# Altium project ADCBoard.PrjPCB
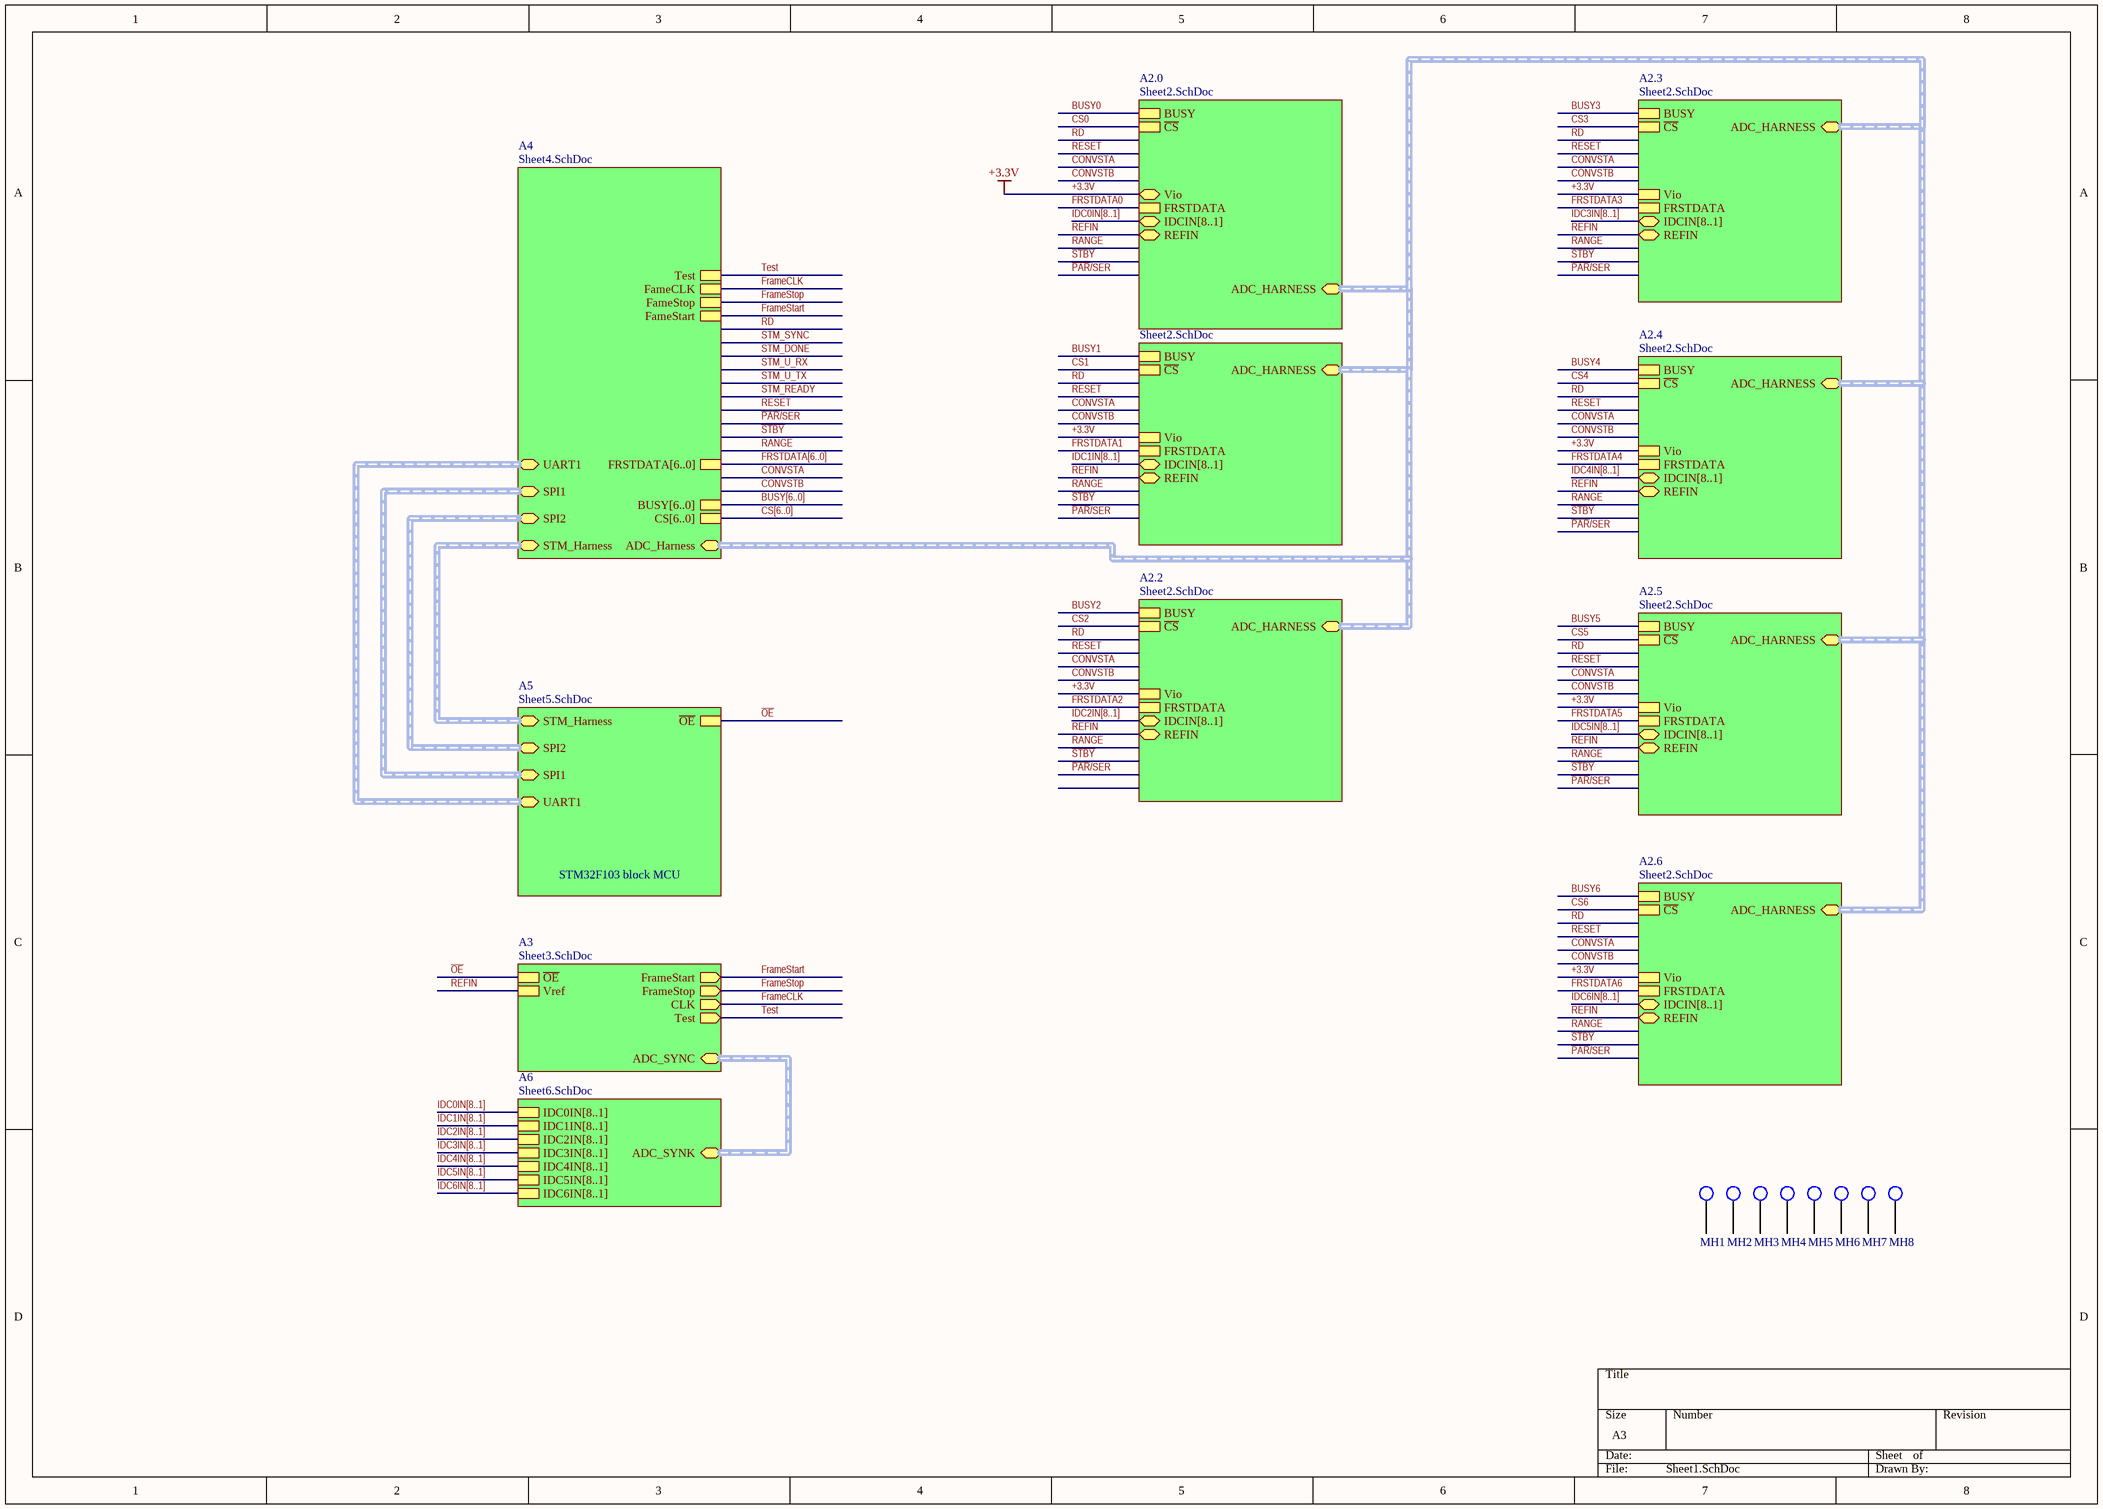
[diagram p0: Sheet1.SchDoc]
6 sheets, 430 parts. Net scope: hierarchical (ports join the sheet entries above them; power ports are global).
Board file: ADCBoard.PcbDoc
Sheets:
  Sheet1.SchDoc
    A2.3 = Sheet2.SchDoc
    A2.4 = Sheet2.SchDoc
    A2.5 = Sheet2.SchDoc
    A2.6 = Sheet2.SchDoc
    A2.1 = Sheet2.SchDoc
    A2.2 = Sheet2.SchDoc
    A4 = Sheet4.SchDoc
    A3 = Sheet3.SchDoc
    A5 = Sheet5.SchDoc
    A2.0 = Sheet2.SchDoc
    A6 = Sheet6.SchDoc

## Sheet Sheet1.SchDoc
size A3; DocumentNumber: 1; SheetNumber: 1; SheetTotal: 6

### Parts
MH1  HOLE  [MT]  (value not drawn)
MH2  HOLE  [MT]  (value not drawn)
MH3  HOLE  [MT]  (value not drawn)
MH4  HOLE  [MT]  (value not drawn)
MH5  HOLE  [MT]  (value not drawn)
MH6  HOLE  [MT]  (value not drawn)
MH7  HOLE  [MT]  (value not drawn)
MH8  HOLE  [MT]  (value not drawn)

### Sub-sheets
A2.0 = Sheet2.SchDoc: BUSY, ~{CS}, FRSTDATA, ADC_HARNESS (harness ADC_Harness), Vio, IDCIN[8..1], REFIN
A2.1 = Sheet2.SchDoc: BUSY, ~{CS}, Vio, FRSTDATA, ADC_HARNESS (harness ADC_Harness), IDCIN[8..1], REFIN
A2.2 = Sheet2.SchDoc: BUSY, ~{CS}, Vio, FRSTDATA, ADC_HARNESS (harness ADC_Harness), IDCIN[8..1], REFIN
A2.3 = Sheet2.SchDoc: BUSY, ~{CS}, Vio, FRSTDATA, ADC_HARNESS (harness ADC_Harness), IDCIN[8..1], REFIN
A2.4 = Sheet2.SchDoc: BUSY, ~{CS}, Vio, FRSTDATA, ADC_HARNESS (harness ADC_Harness), IDCIN[8..1], REFIN
A2.5 = Sheet2.SchDoc: BUSY, ~{CS}, Vio, FRSTDATA, ADC_HARNESS (harness ADC_Harness), IDCIN[8..1], REFIN
A2.6 = Sheet2.SchDoc: BUSY, ~{CS}, Vio, FRSTDATA, ADC_HARNESS (harness ADC_Harness), IDCIN[8..1], REFIN
A3 = Sheet3.SchDoc: FrameStart (out), FrameStop (out), CLK (out), ~{OE}, Test (out), Vref, ADC_SYNC (harness ADC_SYNC)
A4 = Sheet4.SchDoc: CS[6..0], BUSY[6..0], FRSTDATA[6..0], FameStart, FameStop, FameCLK, Test, ADC_Harness (harness ADC_Harness), STM_Harness (harness STM_Harness), SPI1 (harness SPI), SPI2 (harness SPI), UART1 (harness UART)
A5 = Sheet5.SchDoc: ~{OE}, STM_Harness (harness STM_Harness), SPI1 (harness SPI), SPI2 (harness SPI), UART1 (harness UART)  | BlockTitle: STM32F103 block MCU
A6 = Sheet6.SchDoc: IDC0IN[8..1], IDC1IN[8..1], IDC2IN[8..1], IDC3IN[8..1], IDC4IN[8..1], IDC5IN[8..1], IDC6IN[8..1], ADC_SYNK (harness ADC_SYNC)

### Nets
+3.3V: sheet A2.3/Vio, sheet A2.4/Vio, sheet A2.5/Vio, sheet A2.6/Vio, sheet A2.1/Vio, sheet A2.2/Vio, sheet A2.0/Vio
FrameCLK: sheet A4/FameCLK, sheet A3/CLK  [project net CLK]
FrameStart: sheet A4/FameStart, sheet A3/FrameStart
FrameStop: sheet A4/FameStop, sheet A3/FrameStop
~{OE}: sheet A3/~{OE}, sheet A5/~{OE}
REFIN: sheet A2.3/REFIN, sheet A2.4/REFIN, sheet A2.5/REFIN, sheet A2.6/REFIN, sheet A2.1/REFIN, sheet A2.2/REFIN, sheet A3/Vref, sheet A2.0/REFIN
Test: sheet A4/Test, sheet A3/Test

Not connected (* = marked no-connect by the designer): MH1 1; MH2 1; MH3 1; MH4 1; MH5 1; MH6 1; MH7 1; MH8 1

### Buses and harness runs
bus BUSY[6..0] = sheet A4/BUSY[6..0]
bus CS[6..0] = sheet A4/CS[6..0]
bus FRSTDATA[6..0] = sheet A4/FRSTDATA[6..0]
bus IDC0IN[8..1] = sheet A2.0/IDCIN[8..1]
bus IDC0IN[8..1] = sheet A6/IDC0IN[8..1]
bus IDC1IN[8..1] = sheet A2.1/IDCIN[8..1]
bus IDC1IN[8..1] = sheet A6/IDC1IN[8..1]
bus IDC2IN[8..1] = sheet A2.2/IDCIN[8..1]
bus IDC2IN[8..1] = sheet A6/IDC2IN[8..1]
bus IDC3IN[8..1] = sheet A2.3/IDCIN[8..1]
bus IDC3IN[8..1] = sheet A6/IDC3IN[8..1]
bus IDC4IN[8..1] = sheet A2.4/IDCIN[8..1]
bus IDC4IN[8..1] = sheet A6/IDC4IN[8..1]
bus IDC5IN[8..1] = sheet A2.5/IDCIN[8..1]
bus IDC5IN[8..1] = sheet A6/IDC5IN[8..1]
bus IDC6IN[8..1] = sheet A2.6/IDCIN[8..1]
bus IDC6IN[8..1] = sheet A6/IDC6IN[8..1]
harness sheet A2.0/ADC_HARNESS = sheet A2.1/ADC_HARNESS = sheet A2.2/ADC_HARNESS = sheet A2.3/ADC_HARNESS = sheet A2.4/ADC_HARNESS = sheet A2.5/ADC_HARNESS = sheet A2.6/ADC_HARNESS = sheet A4/ADC_Harness
harness sheet A3/ADC_SYNC = sheet A6/ADC_SYNK
harness sheet A4/SPI1 = sheet A5/SPI1
harness sheet A4/SPI2 = sheet A5/SPI2
harness sheet A4/STM_Harness = sheet A5/STM_Harness
harness sheet A4/UART1 = sheet A5/UART1

### Library data of the parts
MH1-MH8 = MT

## Sheet Sheet2.SchDoc
size A3; DocumentNumber: 2; SheetNumber: 2; SheetTotal: 6
Used 7 times, as channels A2.3, A2.4, A2.5, A2.6, A2.1, A2.2, A2.0. Parts and nets are listed once, with the designators drawn on the sheet.
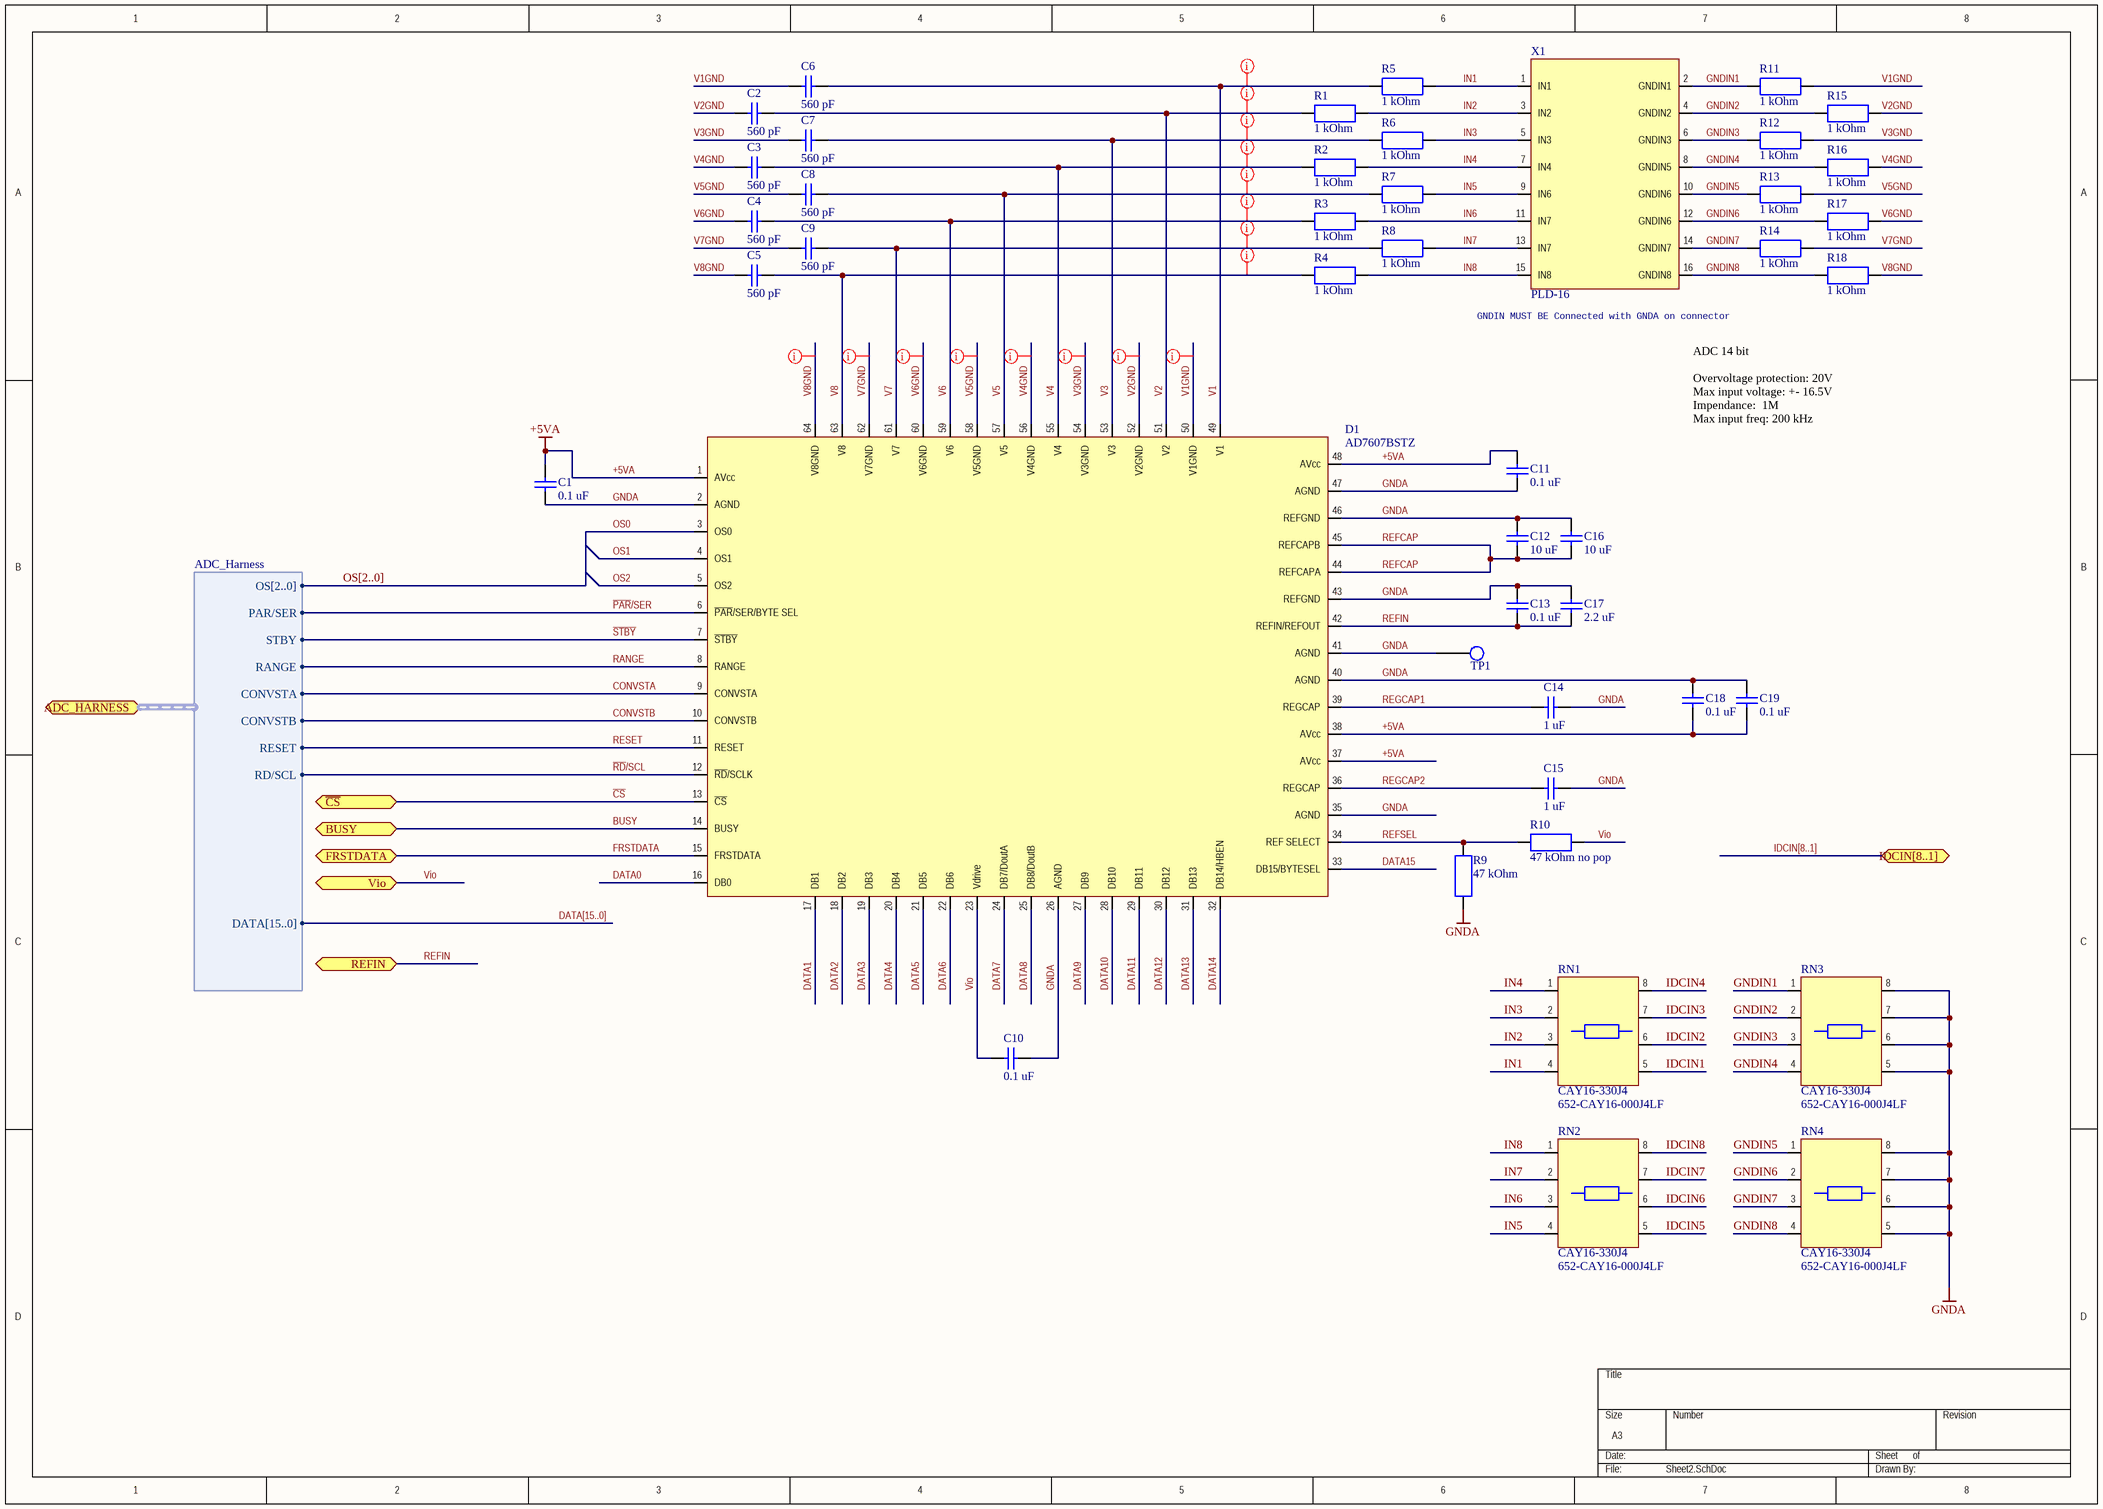
[diagram p1: Sheet2.SchDoc]

### Parts
C1  0.1 uF  [CAPC1608N]
C2  560 pF  [CAPC1608N]
C3  560 pF  [CAPC1608N]
C4  560 pF  [CAPC1608N]
C5  560 pF  [CAPC1608N]
C6  560 pF  [CAPC1608N]
C7  560 pF  [CAPC1608N]
C8  560 pF  [CAPC1608N]
C9  560 pF  [CAPC1608N]
C10  0.1 uF  [CAPC1608N]
C11  0.1 uF  [CAPC1608N]
C12  10 uF  [CAPC1608N]
C13  0.1 uF  [CAPC1608N]
C14  1 uF  [CAPC1608N]
C15  1 uF  [CAPC1608N]
C16  10 uF  [CAPC1608N]
C17  2.2 uF  [CAPC1608N]
C18  0.1 uF  [CAPC1608N]
C19  0.1 uF  [CAPC1608N]
D1  AD7607BSTZ  [TSQFP50P1200X1200X160-64N]
R1  1 kOhm  [RESC1608N]
R2  1 kOhm  [RESC1608N]
R3  1 kOhm  [RESC1608N]
R4  1 kOhm  [RESC1608N]
R5  1 kOhm  [RESC1608N]
R6  1 kOhm  [RESC1608N]
R7  1 kOhm  [RESC1608N]
R8  1 kOhm  [RESC1608N]
R9  47 kOhm  [RESC1608N]
R10  47 kOhm no pop  [RESC1608N]
R11  1 kOhm  [RESC1608N]
R12  1 kOhm  [RESC1608N]
R13  1 kOhm  [RESC1608N]
R14  1 kOhm  [RESC1608N]
R15  1 kOhm  [RESC1608N]
R16  1 kOhm  [RESC1608N]
R17  1 kOhm  [RESC1608N]
R18  1 kOhm  [RESC1608N]
RN1  CAY16-330J4  Supplier Part Number 1: 652-CAY16-000J4LF  [EXB38V]
RN2  CAY16-330J4  Supplier Part Number 1: 652-CAY16-000J4LF  [EXB38V]
RN3  CAY16-330J4  Supplier Part Number 1: 652-CAY16-000J4LF  [EXB38V]
RN4  CAY16-330J4  Supplier Part Number 1: 652-CAY16-000J4LF  [EXB38V]
TP1  PLS-1  [TPSW]  (value not drawn)
X1  PLD-16  [PLD-16]

### Ports
ADC_HARNESS (harness ADC_Harness), BUSY, FRSTDATA, IDCIN[8..1], REFIN, Vio, ~{CS}

### Harnesses
ADC_Harness: OS[2..0], PAR/SER, RANGE, STBY, CONVSTA, CONVSTB, RESET, RD/SCL, DATA[15..0]

### Nets
+5VA: C1.2 C11.2 C18.1 C19.1 D1.1(AVcc) D1.37(AVcc) D1.38(AVcc) D1.48(AVcc)
GNDA: C1.1 C10.1 C11.1 C12.2 C13.2 C14.1 C15.1 C16.2 C17.2 C18.2 C19.2 D1.2(AGND) D1.26(AGND) D1.35(AGND) D1.40(AGND) D1.41(AGND) D1.43(REFGND) D1.46(REFGND) D1.47(AGND) R9.1 RN3.5 RN3.6 RN3.7 RN3.8 RN4.5 RN4.6 RN4.7 RN4.8 TP1.1
BUSY: D1.14(BUSY) ; port BUSY
~{CS}: D1.13(~{CS}) ; port ~{CS}
CONVSTA: D1.9(CONVSTA) ; port ADC_HARNESS.CONVSTA
CONVSTB: D1.10(CONVSTB) ; port ADC_HARNESS.CONVSTB
DATA0: D1.16(DB0)
DATA1: D1.17(DB1)
DATA2: D1.18(DB2)
DATA3: D1.19(DB3)
DATA4: D1.20(DB4)
DATA5: D1.21(DB5)
DATA6: D1.22(DB6)
DATA7: D1.24(DB7/DoutA)
DATA8: D1.25(DB8/DoutB)
DATA9: D1.27(DB9)
DATA10: D1.28(DB10)
DATA11: D1.29(DB11)
DATA12: D1.30(DB12)
DATA13: D1.31(DB13)
DATA14: D1.32(DB14/HBEN)
DATA15: D1.33(DB15/BYTESEL)
FRSTDATA: D1.15(FRSTDATA) ; port FRSTDATA
GNDIN1: R11.1 RN3.1 X1.2(GNDIN1)
GNDIN2: R15.1 RN3.2 X1.4(GNDIN2)
GNDIN3: R12.1 RN3.3 X1.6(GNDIN3)
GNDIN4: R16.1 RN3.4 X1.8(GNDIN5)
GNDIN5: R13.1 RN4.1 X1.10(GNDIN6)
GNDIN6: R17.1 RN4.2 X1.12(GNDIN6)
GNDIN7: R14.1 RN4.3 X1.14(GNDIN7)
GNDIN8: R18.1 RN4.4 X1.16(GNDIN8)
IDCIN1: RN1.5
IDCIN2: RN1.6
IDCIN3: RN1.7
IDCIN4: RN1.8
IDCIN5: RN2.5
IDCIN6: RN2.6
IDCIN7: RN2.7
IDCIN8: RN2.8
IN1: R5.1 RN1.4 X1.1(IN1)
IN2: R1.1 RN1.3 X1.3(IN2)
IN3: R6.1 RN1.2 X1.5(IN3)
IN4: R2.1 RN1.1 X1.7(IN4)
IN5: R7.1 RN2.4 X1.9(IN6)
IN6: R3.1 RN2.3 X1.11(IN7)
IN7: R8.1 RN2.2 X1.13(IN7)
IN8: R4.1 RN2.1 X1.15(IN8)
OS0: D1.3(OS0)
OS1: D1.4(OS1)
OS2: D1.5(OS2)
~{PAR}/SER: D1.6(~{PAR}/SER/BYTE_SEL) ; port ADC_HARNESS.PAR/SER
~{RD}/SCL: D1.12(~{RD}/SCLK) ; port ADC_HARNESS.RD/SCL
RANGE: D1.8(RANGE) ; port ADC_HARNESS.RANGE
REFCAP: C12.1 C16.1 D1.44(REFCAPA) D1.45(REFCAPB)
REFIN: C13.1 C17.1 D1.42(REFIN/REFOUT) ; port REFIN
REFSEL: D1.34(REF_SELECT) R9.2 R10.2
REGCAP1: C14.2 D1.39(REGCAP)
REGCAP2: C15.2 D1.36(REGCAP)
RESET: D1.11(RESET) ; port ADC_HARNESS.RESET
~{STBY}: D1.7(~{STBY}) ; port ADC_HARNESS.STBY
V1: C6.2 D1.49(V1) R5.2
V1GND: C6.1 D1.50(V1GND) R11.2
V2: C2.2 D1.51(V2) R1.2
V2GND: C2.1 D1.52(V2GND) R15.2
V3: C7.2 D1.53(V3) R6.2
V3GND: C7.1 D1.54(V3GND) R12.2
V4: C3.2 D1.55(V4) R2.2
V4GND: C3.1 D1.56(V4GND) R16.2
V5: C8.2 D1.57(V5) R7.2
V5GND: C8.1 D1.58(V5GND) R13.2
V6: C4.2 D1.59(V6) R3.2
V6GND: C4.1 D1.60(V6GND) R17.2
V7: C9.2 D1.61(V7) R8.2
V7GND: C9.1 D1.62(V7GND) R14.2
V8: C5.2 D1.63(V8) R4.2
V8GND: C5.1 D1.64(V8GND) R18.2
Vio: C10.2 D1.23(Vdrive) R10.1 ; port Vio

### Channels
A2.3: designators end in _A2.3; ports BUSY=BUSY FRSTDATA=FRSTDATA REFIN=REFIN Vio=+3.3V ~{CS}=~{CS}
A2.4: designators end in _A2.4; ports BUSY=BUSY FRSTDATA=FRSTDATA REFIN=REFIN Vio=+3.3V ~{CS}=~{CS}
A2.5: designators end in _A2.5; ports BUSY=BUSY FRSTDATA=FRSTDATA REFIN=REFIN Vio=+3.3V ~{CS}=~{CS}
A2.6: designators end in _A2.6; ports BUSY=BUSY FRSTDATA=FRSTDATA REFIN=REFIN Vio=+3.3V ~{CS}=~{CS}
A2.1: designators end in _A2.1; ports BUSY=BUSY FRSTDATA=FRSTDATA REFIN=REFIN Vio=+3.3V ~{CS}=~{CS}
A2.2: designators end in _A2.2; ports BUSY=BUSY FRSTDATA=FRSTDATA REFIN=REFIN Vio=+3.3V ~{CS}=~{CS}
A2.0: designators end in _A2.0; ports BUSY=BUSY FRSTDATA=FRSTDATA REFIN=REFIN Vio=+3.3V ~{CS}=~{CS}

### Buses and harness runs
bus DATA[15..0]
bus IDCIN[8..1] = port IDCIN[8..1]
bus OS[2..0]

### Layout directives
net class ANALOGIN: V1_A2.3, V1GND_A2.3, V2_A2.3, V2GND_A2.3, V3_A2.3, V3GND_A2.3, V4_A2.3, V4GND_A2.3, V5_A2.3, V5GND_A2.3, V6_A2.3, V6GND_A2.3, V7_A2.3, V7GND_A2.3, V8_A2.3, V8GND_A2.3

### Notes on the sheet
- (near X1) GNDIN MUST BE Connected with GNDA on connector
- ADC 14 bit
  Overvoltage protection: 20V
  Max input voltage: +- 16.5V
  Impendance:  1M
  Max input freq: 200 kHz

### Library data of the parts
C1-C19 = CC0603: ±10%, X7R, 0603; MaxVoltage: 10Vdc; Value: 1µF; Published: 2014; LatestRevisionDate: 2014; LatestRevisionNote: Re-released for DXP Platform.; PackageReference: RAD-0.3; Publisher: DS; PackageDescription: ChipCapasitor; HelpURL: http://product.tdk.com/capacitor/mlcc/en/documents/mlcc_commercial_general_en.pdf; Supplier 1: Digi-Key; Supplier Part Number 1: 445-4998-1-ND
D1 = AD7607BSTZ: AD7607BSTZ ADC Simultan; Supplier 1: Digi-Key; Supplier Part Number 1: AD7607BSTZ-ND
R1-R18 = RES0603: ±5%, 0603; MaxVoltage: 10Vdc; Value: 1µF; Published: 2014; LatestRevisionDate: 2014; LatestRevisionNote: Re-released for DXP Platform.; PackageReference: RAD-0.3; Publisher: DS; PackageDescription: ChipCapasitor; HelpURL: http://product.tdk.com/capacitor/mlcc/en/documents/mlcc_commercial_general_en.pdf
RN1-RN4 = CAY16: 0 Ohm; Supplier 1: Mouser
X1 = ADCIN: ADC connector

## Sheet Sheet4.SchDoc
size A3; DocumentNumber: 4; SheetNumber: 4; SheetTotal: 6
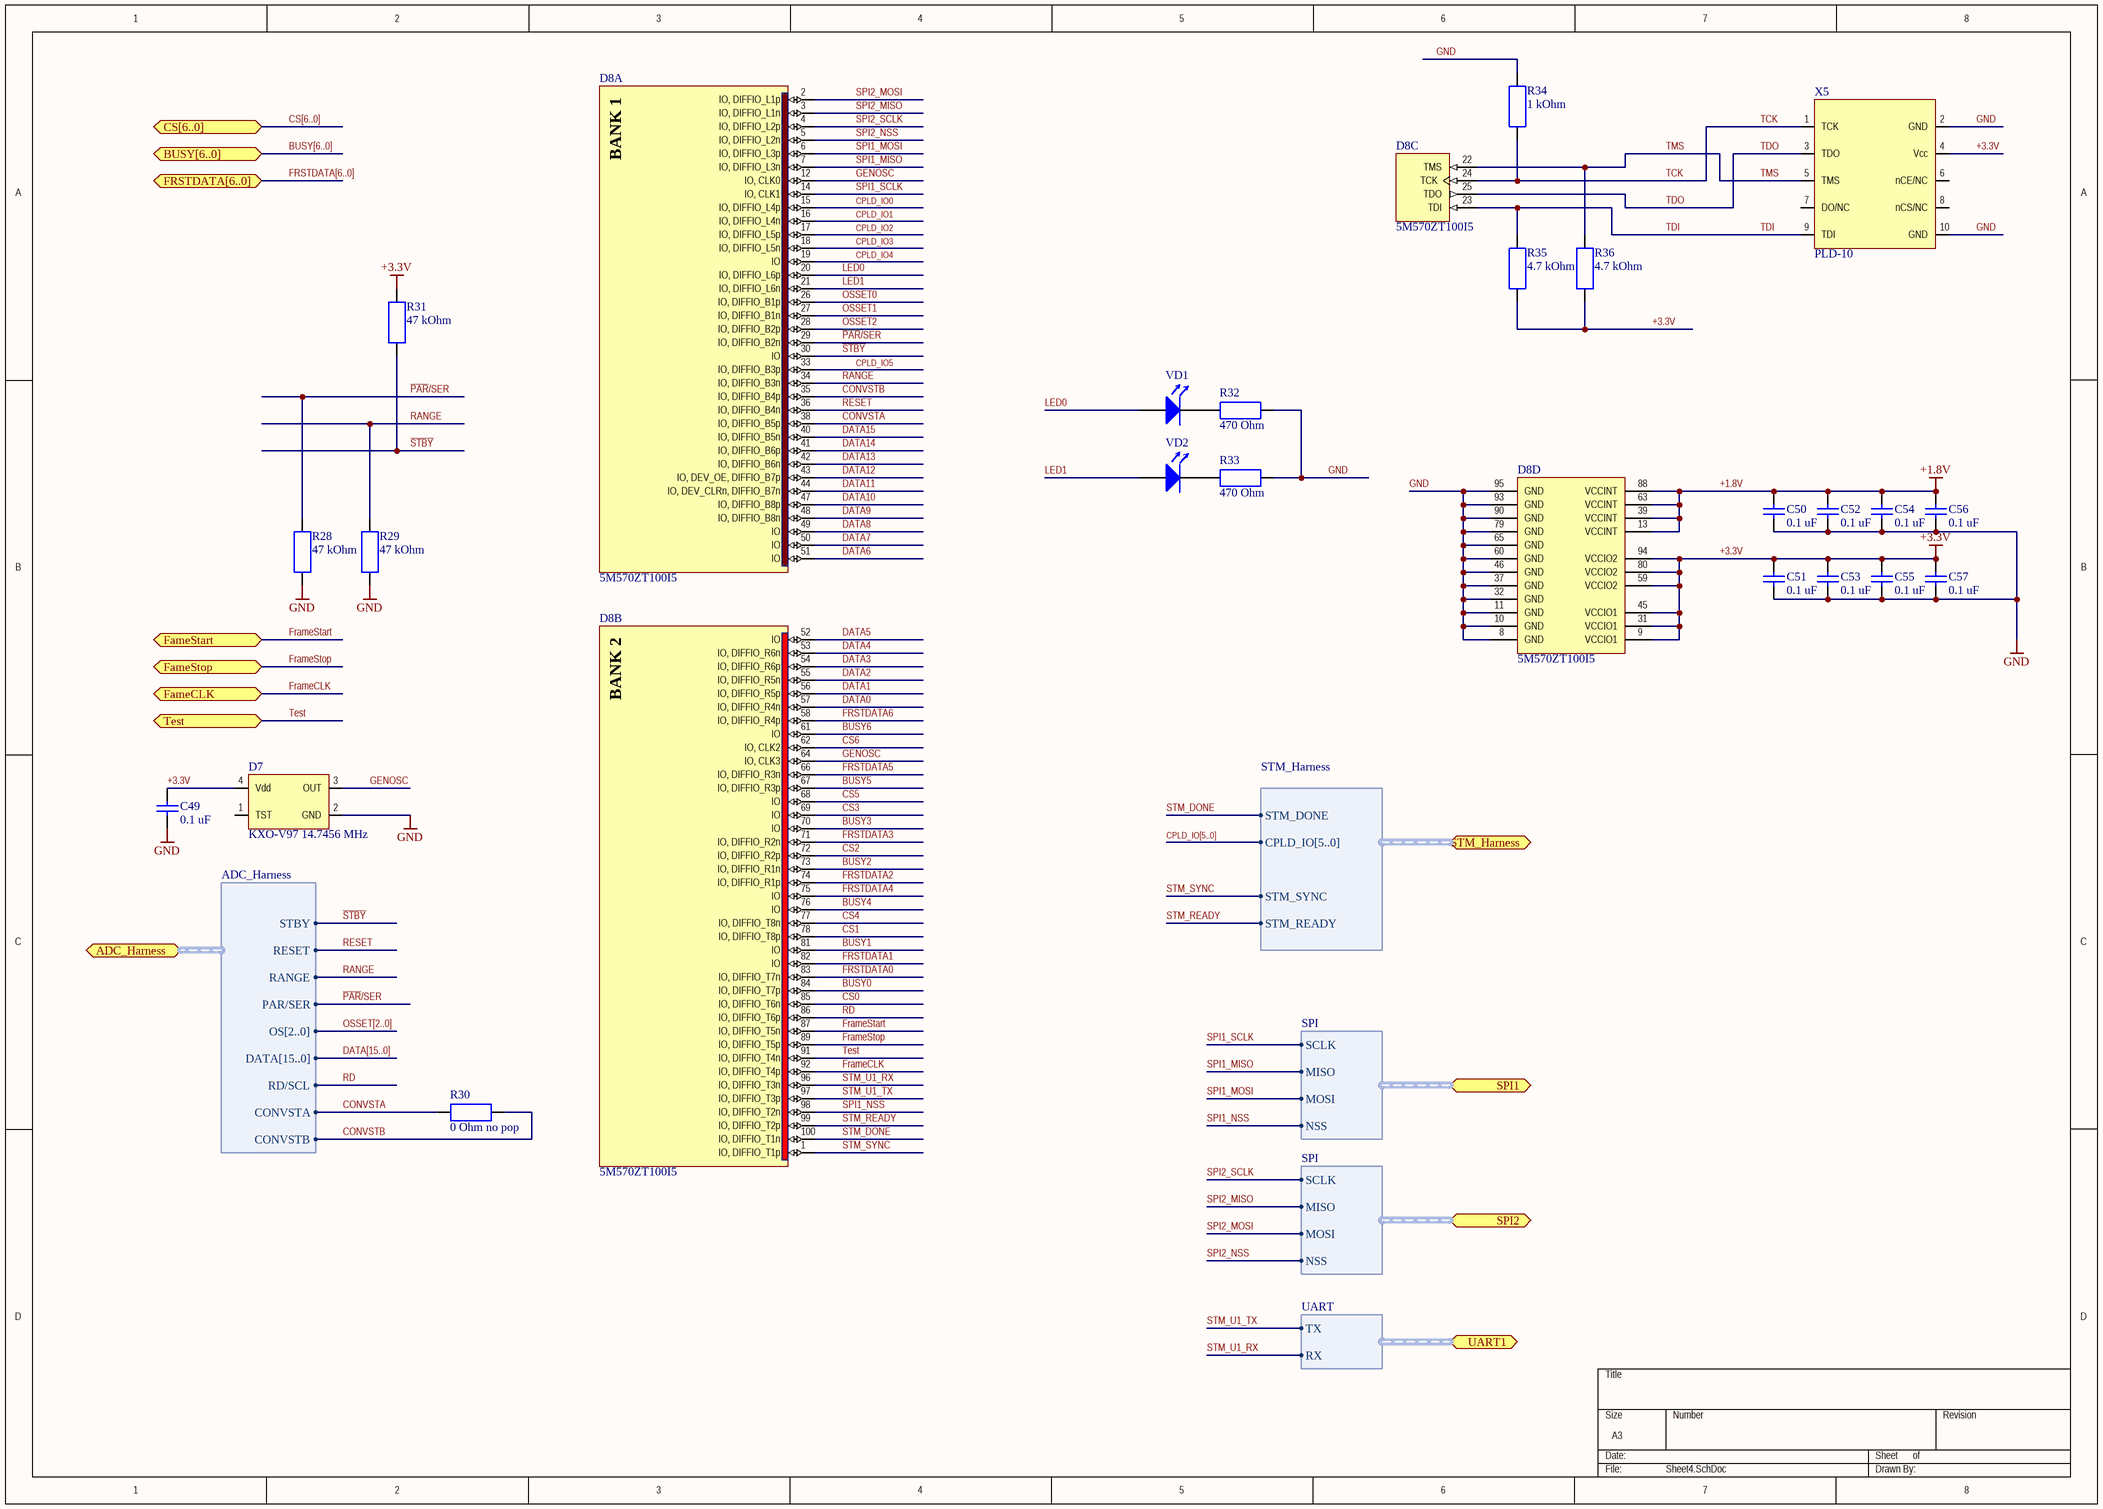
[diagram p2: Sheet4.SchDoc]

### Parts
C49  0.1 uF  [CAPC1608N]
C50  0.1 uF  [CAPC1608N]
C51  0.1 uF  [CAPC1608N]
C52  0.1 uF  [CAPC1608N]
C53  0.1 uF  [CAPC1608N]
C54  0.1 uF  [CAPC1608N]
C55  0.1 uF  [CAPC1608N]
C56  0.1 uF  [CAPC1608N]
C57  0.1 uF  [CAPC1608N]
D7  KXO-V97 14.7456 MHz  [KXO-V97]
D8  5M570ZT100I5  [TQFP100_A-120_L]  (parts A,B,C,D of 4)
R28  47 kOhm  [RESC1608N]
R29  47 kOhm  [RESC1608N]
R30  0 Ohm no pop  [RESC1608N]
R31  47 kOhm  [RESC1608N]
R32  470 Ohm  [RESC1608N]
R33  470 Ohm  [RESC1608N]
R34  1 kOhm  [RESC1608N]
R35  4.7 kOhm  [RESC1608N]
R36  4.7 kOhm  [RESC1608N]
VD1  KP-1608SURC  [LED1608N]  (value not drawn)
VD2  KP-1608SURC  [LED1608N]  (value not drawn)
X5  PLD-10  [PLD-10]

### Ports
ADC_Harness (harness ADC_Harness), BUSY[6..0], CS[6..0], FameCLK, FameStart, FameStop, FRSTDATA[6..0], SPI1 (harness SPI), SPI2 (harness SPI), STM_Harness (harness STM_Harness), Test, UART1 (harness UART)

### Harnesses
ADC_Harness: CONVSTA, CONVSTB, DATA[15..0], OS[2..0], PAR/SER, RANGE, RD/SCL, RESET, STBY
STM_Harness: STM_DONE, STM_SYNC, STM_READY, CPLD_IO[5..0]
SPI: NSS, MOSI, MISO, SCLK
UART: TX, RX

### Nets
+1.8V: C50.2 C52.2 C54.2 C56.2 D8.13(VCCINT) D8.39(VCCINT) D8.63(VCCINT) D8.88(VCCINT)
+3.3V: C49.2 C51.2 C53.2 C55.2 C57.2 D7.4(Vdd) D8.9(VCCIO1) D8.31(VCCIO1) D8.45(VCCIO1) D8.59(VCCIO2) D8.80(VCCIO2) D8.94(VCCIO2) R31.2 R35.2 R36.2 X5.4(Vcc)
GND: C49.1 C50.1 C51.1 C52.1 C53.1 C54.1 C55.1 C56.1 C57.1 D7.2(GND) D8.8(GND) D8.10(GND) D8.11(GND) D8.32(GND) D8.37(GND) D8.46(GND) D8.60(GND) D8.65(GND) D8.79(GND) D8.90(GND) D8.93(GND) D8.95(GND) R28.1 R29.1 R32.2 R33.2 R34.1 X5.2(GND) X5.10(GND)
BUSY0: D8.84(IO,_DIFFIO_T7p)  [project net BUSY]
BUSY1: D8.81(IO)  [project net BUSY]
BUSY2: D8.73(IO,_DIFFIO_R1n)  [project net BUSY]
BUSY3: D8.70(IO)  [project net BUSY]
BUSY4: D8.76(IO)  [project net BUSY]
BUSY5: D8.67(IO,_DIFFIO_R3p)  [project net BUSY]
BUSY6: D8.61(IO)  [project net BUSY]
CONVSTA: D8.38(IO,_DIFFIO_B5p) R30.2 ; port ADC_Harness.CONVSTA
CONVSTB: D8.35(IO,_DIFFIO_B4p) R30.1 ; port ADC_Harness.CONVSTB
CPLD_IO0: D8.15(IO,_DIFFIO_L4p)
CPLD_IO1: D8.16(IO,_DIFFIO_L4n)
CPLD_IO2: D8.17(IO,_DIFFIO_L5p)
CPLD_IO3: D8.18(IO,_DIFFIO_L5n)
CPLD_IO4: D8.19(IO)
CPLD_IO5: D8.33(IO,_DIFFIO_B3p)
CS0: D8.85(IO,_DIFFIO_T6n)  [project net ~{CS}]
CS1: D8.78(IO,_DIFFIO_T8p)  [project net ~{CS}]
CS2: D8.72(IO,_DIFFIO_R2p)  [project net ~{CS}]
CS3: D8.69(IO)  [project net ~{CS}]
CS4: D8.77(IO,_DIFFIO_T8n)  [project net ~{CS}]
CS5: D8.68(IO)  [project net ~{CS}]
CS6: D8.62(IO,_CLK2)  [project net ~{CS}]
DATA0: D8.57(IO,_DIFFIO_R4n)
DATA1: D8.56(IO,_DIFFIO_R5p)
DATA2: D8.55(IO,_DIFFIO_R5n)
DATA3: D8.54(IO,_DIFFIO_R6p)
DATA4: D8.53(IO,_DIFFIO_R6n)
DATA5: D8.52(IO)
DATA6: D8.51(IO)
DATA7: D8.50(IO)
DATA8: D8.49(IO)
DATA9: D8.48(IO,_DIFFIO_B8n)
DATA10: D8.47(IO,_DIFFIO_B8p)
DATA11: D8.44(IO,_DEV_CLRn,_DIFFIO_B7n)
DATA12: D8.43(IO,_DEV_OE,_DIFFIO_B7p)
DATA13: D8.42(IO,_DIFFIO_B6n)
DATA14: D8.41(IO,_DIFFIO_B6p)
DATA15: D8.40(IO,_DIFFIO_B5n)
FrameCLK: D8.92(IO,_DIFFIO_T4p) ; port FameCLK  [project net CLK]
FrameStart: D8.87(IO,_DIFFIO_T5n) ; port FameStart
FrameStop: D8.89(IO,_DIFFIO_T5p) ; port FameStop
FRSTDATA0: D8.83(IO,_DIFFIO_T7n)  [project net FRSTDATA]
FRSTDATA1: D8.82(IO)  [project net FRSTDATA]
FRSTDATA2: D8.74(IO,_DIFFIO_R1p)  [project net FRSTDATA]
FRSTDATA3: D8.71(IO,_DIFFIO_R2n)  [project net FRSTDATA]
FRSTDATA4: D8.75(IO)  [project net FRSTDATA]
FRSTDATA5: D8.66(IO,_DIFFIO_R3n)  [project net FRSTDATA]
FRSTDATA6: D8.58(IO,_DIFFIO_R4p)  [project net FRSTDATA]
GENOSC: D7.3(OUT) D8.12(IO,_CLK0) D8.64(IO,_CLK3)
LED0: D8.20(IO,_DIFFIO_L6p) VD1.1(A)
LED1: D8.21(IO,_DIFFIO_L6n) VD2.1(A)
OSSET0: D8.26(IO,_DIFFIO_B1p)  [project net OS0]
OSSET1: D8.27(IO,_DIFFIO_B1n)  [project net OS1]
OSSET2: D8.28(IO,_DIFFIO_B2p)  [project net OS2]
~{PAR}/SER: D8.29(IO,_DIFFIO_B2n) R28.2 ; port ADC_Harness.PAR/SER
RANGE: D8.34(IO,_DIFFIO_B3n) R29.2 ; port ADC_Harness.RANGE
RD: D8.86(IO,_DIFFIO_T6p) ; port ADC_Harness.RD/SCL  [project net ~{RD}/SCL]
RESET: D8.36(IO,_DIFFIO_B4n) ; port ADC_Harness.RESET
~{STBY}: D8.30(IO) R31.1 ; port ADC_Harness.STBY
SPI1_MISO: D8.7(IO,_DIFFIO_L3n) ; port SPI1.MISO
SPI1_MOSI: D8.6(IO,_DIFFIO_L3p) ; port SPI1.MOSI
SPI1_NSS: D8.98(IO,_DIFFIO_T2n) ; port SPI1.NSS  [project net PA8/U1_CK/TM1]
SPI1_SCLK: D8.14(IO,_CLK1) ; port SPI1.SCLK  [project net SPI1_SCK]
SPI2_MISO: D8.3(IO,_DIFFIO_L1n) ; port SPI2.MISO  [project net PB14/SPI2_MISO/U3RTS]
SPI2_MOSI: D8.2(IO,_DIFFIO_L1p) ; port SPI2.MOSI  [project net PB15/SPI2_MOSI]
SPI2_NSS: D8.5(IO,_DIFFIO_L2n) ; port SPI2.NSS  [project net PB12/SPI2_NSS/I2C2_SMBA]
SPI2_SCLK: D8.4(IO,_DIFFIO_L2p) ; port SPI2.SCLK  [project net PB13/SPI2_SCK/U3CTS]
STM_DONE: D8.100(IO,_DIFFIO_T1n) ; port STM_Harness.STM_DONE
STM_READY: D8.99(IO,_DIFFIO_T2p) ; port STM_Harness.STM_READY  [project net STM_PC9]
STM_SYNC: D8.1(IO,_DIFFIO_T1p) ; port STM_Harness.STM_SYNC  [project net STM_PC7]
STM_U1_RX: D8.96(IO,_DIFFIO_T3n) ; port UART1.RX
STM_U1_TX: D8.97(IO,_DIFFIO_T3p) ; port UART1.TX
TCK: D8.24(TCK) R34.2 X5.1(TCK)
TDI: D8.23(TDI) R35.1 X5.9(TDI)
TDO: D8.25(TDO) X5.3(TDO)
Test: D8.91(IO,_DIFFIO_T4n) ; port Test
TMS: D8.22(TMS) R36.1 X5.5(TMS)
NetR32_1: R32.1 VD1.2(K)
NetR33_1: R33.1 VD2.2(K)

Not connected (* = marked no-connect by the designer): D7 1(TST); X5 6(nCE/NC) 7(DO/NC) 8(nCS/NC)

### Buses and harness runs
bus BUSY[6..0] = port BUSY[6..0]
bus CPLD_IO[5..0]
bus CS[6..0] = port CS[6..0]
bus DATA[15..0]
bus FRSTDATA[6..0] = port FRSTDATA[6..0]
bus OSSET[2..0]

### Notes on the sheet
- (in symbol 5M570ZT100I5, part A) BANK 1
- (in symbol 5M570ZT100I5, part B) BANK 2

### Library data of the parts
C49-C57 = CC0603: as C1 on sheet Sheet2; Published: 2014; LatestRevisionDate: 2014; LatestRevisionNote: Re-released for DXP Platform.; PackageReference: RAD-0.3; Publisher: DS; PackageDescription: ChipCapasitor; HelpURL: http://product.tdk.com/capacitor/mlcc/en/documents/mlcc_commercial_general_en.pdf; Supplier 1: Digi-Key; Supplier Part Number 1: 445-4998-1-ND
D8 = 5M570ZT100I5: MAX V 1.8V CPLD, 74 IOs, 570 Logic Elements, 100-Pin TQFP, Industrial Temperature, Speed Grade 5; DatasheetVersion: ver1.2, May-2011; PackageVersion: ver1.0, Jul-2011; PackageReference: TQFP100_A-120; PackageDescription: 100-Pin Plastic Thin Quad Flat Pack (TQFP) - Wire Bond - A:1.20; Code_JEDEC: MS-029-AED; ComponentLink1Description: Manufacturer URL; ComponentLink1URL: http://www.altera.com/; ComponentLink2Description: Datasheet; ComponentLink2URL: http://www.altera.com/literature/hb/max-v/max5_handbook.pdf; ComponentLink3Description: MAX V Device Pin-Out files; ComponentLink3URL: http://www.altera.com/literature/lit-dp.jsp?category=MAX%205&showspreadsheet=y; ComponentLink4Description: Package Specification; ComponentLink4URL: http://www.altera.com/devicepackaging/04R00365-01.pdf
R28-R36 = RES0603: ±5%, 0603; MaxVoltage: 10Vdc; Value: 1µF; Published: 2014; LatestRevisionDate: 2014; LatestRevisionNote: Re-released for DXP Platform.; PackageReference: RAD-0.3; Publisher: DS; PackageDescription: ChipCapasitor; HelpURL: http://product.tdk.com/capacitor/mlcc/en/documents/mlcc_commercial_general_en.pdf
X5 = BYTEBLASTER
VD1 VD2 = KP-1608SURC: Published: 29-Sep-2000; LatestRevisionDate: 17-Jul-2002; LatestRevisionNote: Re-released for DXP Platform.; PackageReference: 299-02; Publisher: Altium Limited; PackageDescription: Diode, Axial; Body 5.1 x 2.3 mm (LxDia. max), Lead Dia. 0.56 mm (max); Code_JEDEC: DO-204-AH; ComponentLink1Description: Manufacturer Link; ComponentLink1URL: http://www.onsemi.com/site/products/landing?taxonomyID=194

## Sheet Sheet3.SchDoc
size A3; DocumentNumber: 3; SheetNumber: 3; SheetTotal: 6
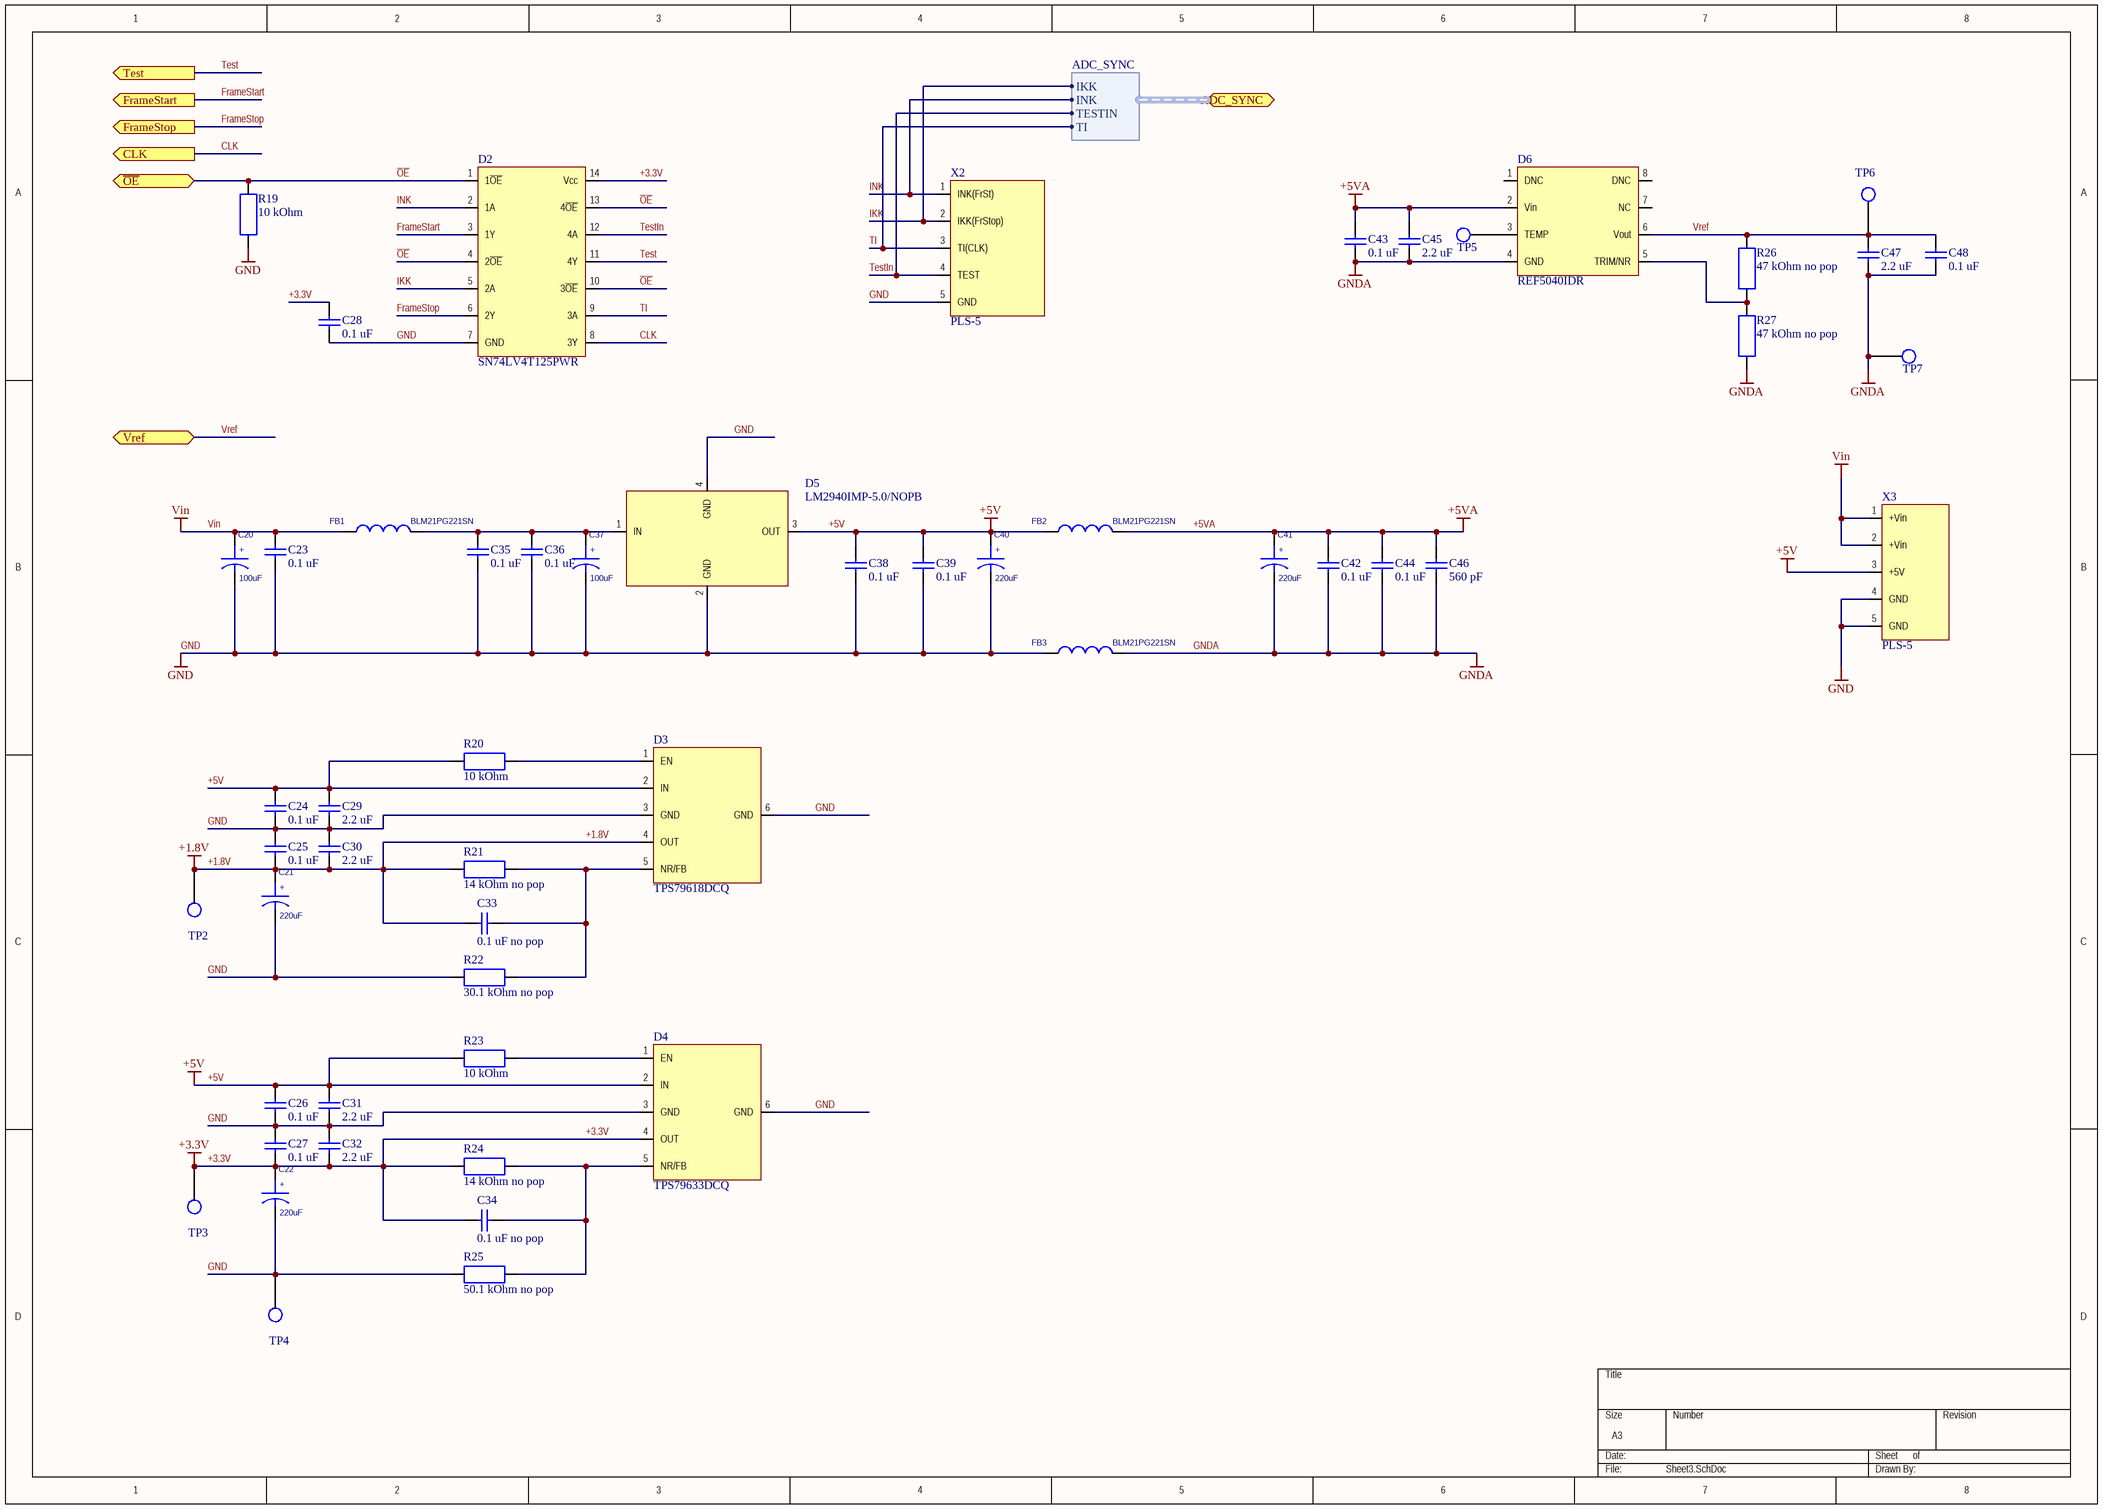
[diagram p3: Sheet3.SchDoc]

### Parts
C20  100uF  [TC7343-2917]
C21  220uF  [TC7343-2917]
C22  220uF  [TC7343-2917]
C23  0.1 uF  [CAPC1608N]
C24  0.1 uF  [CAPC1608N]
C25  0.1 uF  [CAPC1608N]
C26  0.1 uF  [CAPC1608N]
C27  0.1 uF  [CAPC1608N]
C28  0.1 uF  [CAPC1608N]
C29  2.2 uF  [CAPC1608N]
C30  2.2 uF  [CAPC1608N]
C31  2.2 uF  [CAPC1608N]
C32  2.2 uF  [CAPC1608N]
C33  0.1 uF no pop  [CAPC1608N]
C34  0.1 uF no pop  [CAPC1608N]
C35  0.1 uF  [CAPC1608N]
C36  0.1 uF  [CAPC1608N]
C37  100uF  [TC7343-2917]
C38  0.1 uF  [CAPC1608N]
C39  0.1 uF  [CAPC1608N]
C40  220uF  [TC7343-2917]
C41  220uF  [TC7343-2917]
C42  0.1 uF  [CAPC1608N]
C43  0.1 uF  [CAPC1608N]
C44  0.1 uF  [CAPC1608N]
C45  2.2 uF  [CAPC1608N]
C46  560 pF  [CAPC1608N]
C47  2.2 uF  [CAPC1608N]
C48  0.1 uF  [CAPC1608N]
D2  SN74LV4T125PWR  [TSOP65P640X120-14N]
D3  TPS79618DCQ  [SOT127P706X180-6N]
D4  TPS79633DCQ  [SOT127P706X180-6N]
D5  LM2940IMP-5.0/NOPB  [SOT230P700X180-4N]
D6  REF5040IDR  [SO8]
FB1  BLM21PG221SN  [INDC2009M]
FB2  BLM21PG221SN  [INDC2009M]
FB3  BLM21PG221SN  [INDC2009M]
R19  10 kOhm  [RESC1608N]
R20  10 kOhm  [RESC1608N]
R21  14 kOhm no pop  [RESC1608N]
R22  30.1 kOhm no pop  [RESC1608N]
R23  10 kOhm  [RESC1608N]
R24  14 kOhm no pop  [RESC1608N]
R25  50.1 kOhm no pop  [RESC1608N]
R26  47 kOhm no pop  [RESC1608N]
R27  47 kOhm no pop  [RESC1608N]
TP2  PLS-1  [TPSW]  (value not drawn)
TP3  PLS-1  [TPSW]  (value not drawn)
TP4  PLS-1  [TPSW]  (value not drawn)
TP5  PLS-1  [TPSW]  (value not drawn)
TP6  PLS-1  [TPSW]  (value not drawn)
TP7  PLS-1  [TPSW]  (value not drawn)
X2  PLS-5  [PLS-5]
X3  PLS-5  [PLS-5]

### Ports
ADC_SYNC (harness ADC_SYNC), CLK (out), FrameStart (out), FrameStop (out), Test (out), Vref, ~{OE}

### Harnesses
ADC_SYNC: IKK, INK, TESTIN, TI

### Nets
+1.8V: C21.1(Positive) C25.1 C30.1 C33.2 D3.4(OUT) R21.2 TP2.1
+3.3V: C22.1(Positive) C27.1 C28.2 C32.1 C34.2 D2.14(Vcc) D4.4(OUT) R24.2 TP3.1
+5V: C24.2 C26.2 C29.2 C31.2 C38.2 C39.2 C40.1(Positive) D3.2(IN) D4.2(IN) D5.3(OUT) FB2.1 R20.2 R23.2 X3.3(+5V)
+5VA: C41.1(Positive) C42.2 C43.2 C44.2 C45.2 C46.2 D6.2(Vin) FB2.2
GND: C20.2(Negative) C21.2(Negative) C22.2(Negative) C23.1 C24.1 C25.2 C26.1 C27.2 C28.1 C29.1 C30.2 C31.1 C32.2 C35.1 C36.1 C37.2(Negative) C38.1 C39.1 C40.2(Negative) D2.7(GND) D3.3(GND) D3.6(GND) D4.3(GND) D4.6(GND) D5.2(GND) D5.4(GND) FB3.1 R19.1 R22.2 R25.2 TP4.1 X2.5(GND) X3.4(GND) X3.5(GND)
GNDA: C41.2(Negative) C42.1 C43.1 C44.1 C45.1 C46.1 C47.1 C48.1 D6.4(GND) FB3.2 R27.2 TP7.1
Vin: C20.1(Positive) C23.2 FB1.1 X3.1(+Vin) X3.2(+Vin)
CLK: D2.8(3Y) ; port CLK
FrameStart: D2.3(1Y) ; port FrameStart
FrameStop: D2.6(2Y) ; port FrameStop
IKK: D2.5(2A) X2.2(IKK(FrStop)) ; port ADC_SYNC.IKK
INK: D2.2(1A) X2.1(INK(FrSt)) ; port ADC_SYNC.INK
~{OE}: D2.1(1~{OE}) D2.4(2~{OE}) D2.10(3~{OE}) D2.13(4~{OE}) R19.2 ; port ~{OE}
Test: D2.11(4Y) ; port Test
TestIn: D2.12(4A) X2.4(TEST) ; port ADC_SYNC.TESTIN
TI: D2.9(3A) X2.3(TI(CLK)) ; port ADC_SYNC.TI
Vref: C47.2 C48.2 D6.6(Vout) R26.2 TP6.1 ; port Vref  [project net REFIN]
NetC33_1: C33.1 D3.5(NR/FB) R21.1 R22.1
NetC34_1: C34.1 D4.5(NR/FB) R24.1 R25.1
NetC35_2: C35.2 C36.2 C37.1(Positive) D5.1(IN) FB1.2
NetD3_1: D3.1(EN) R20.1
NetD4_1: D4.1(EN) R23.1
NetD6_3: D6.3(TEMP) TP5.1
NetD6_5: D6.5(TRIM/NR) R26.1 R27.1

Not connected (* = marked no-connect by the designer): D6 1(DNC) 7(NC) 8(DNC)

### Notes on the sheet
- (in symbol CAP TANTAL CASE E) +

### Library data of the parts
C20-C22 C37 C40 C41 = CAP TANTAL CASE E: Vendor Part#: 495-2256-1-ND; Mfg Part#: B45196H3107M409; Vendor: DigiKey; Mfg: Kemet; Specifications: CAP TANTALUM 100UF 16V 20% SMD; Oper. Temp. Range: -55C to 125C; RoHS: Yes; Package: 7343-31
C23-C36 C38 C39 C42-C48 = CC0603: as C1 on sheet Sheet2; Published: 2014; LatestRevisionDate: 2014; LatestRevisionNote: Re-released for DXP Platform.; PackageReference: RAD-0.3; Publisher: DS; PackageDescription: ChipCapasitor; HelpURL: http://product.tdk.com/capacitor/mlcc/en/documents/mlcc_commercial_general_en.pdf; Supplier 1: Digi-Key; Supplier Part Number 1: 445-4998-1-ND
D2 = SN74LV4T125PWR: SN74LV4T125PWR voltage level converter; Supplier 1: Mouser; Supplier Part Number 1: 595-SN74LV4T125PWR
D5 = LM2940IMP-5.0/NOPB: 5V LDO
FB1-FB3 = BLM21: Mfg Part#: BLM18PG121SN1D; Vendor Part#: 490-1037-1-ND; Mfg: Murata; Vendor: DigiKey; Specifications: FERRITE CHIP 120 OHM 2000MA 0603; Oper. Temp. Range: -55C to 125C; Package: 0603; RoHS: Yes; Supplier 1: Digi-Key; Supplier Part Number 1: 490-1054-6-ND
R19-R27 = RES0603: ±5%, 0603; MaxVoltage: 10Vdc; Value: 1µF; Published: 2014; LatestRevisionDate: 2014; LatestRevisionNote: Re-released for DXP Platform.; PackageReference: RAD-0.3; Publisher: DS; PackageDescription: ChipCapasitor; HelpURL: http://product.tdk.com/capacitor/mlcc/en/documents/mlcc_commercial_general_en.pdf
X2 = SYNCIN
X3 = PWRIN
D3 = TPS79618DCQ: Supplier 1: Mouser; Supplier Part Number 1: 595-TPS79601DCQR
D4 = TPS79633DCQ: Supplier 1: Mouser; Supplier Part Number 1: 595-TPS79601DCQR

## Sheet Sheet5.SchDoc
size A3; DocumentNumber: 5; SheetNumber: 5; SheetTotal: 6
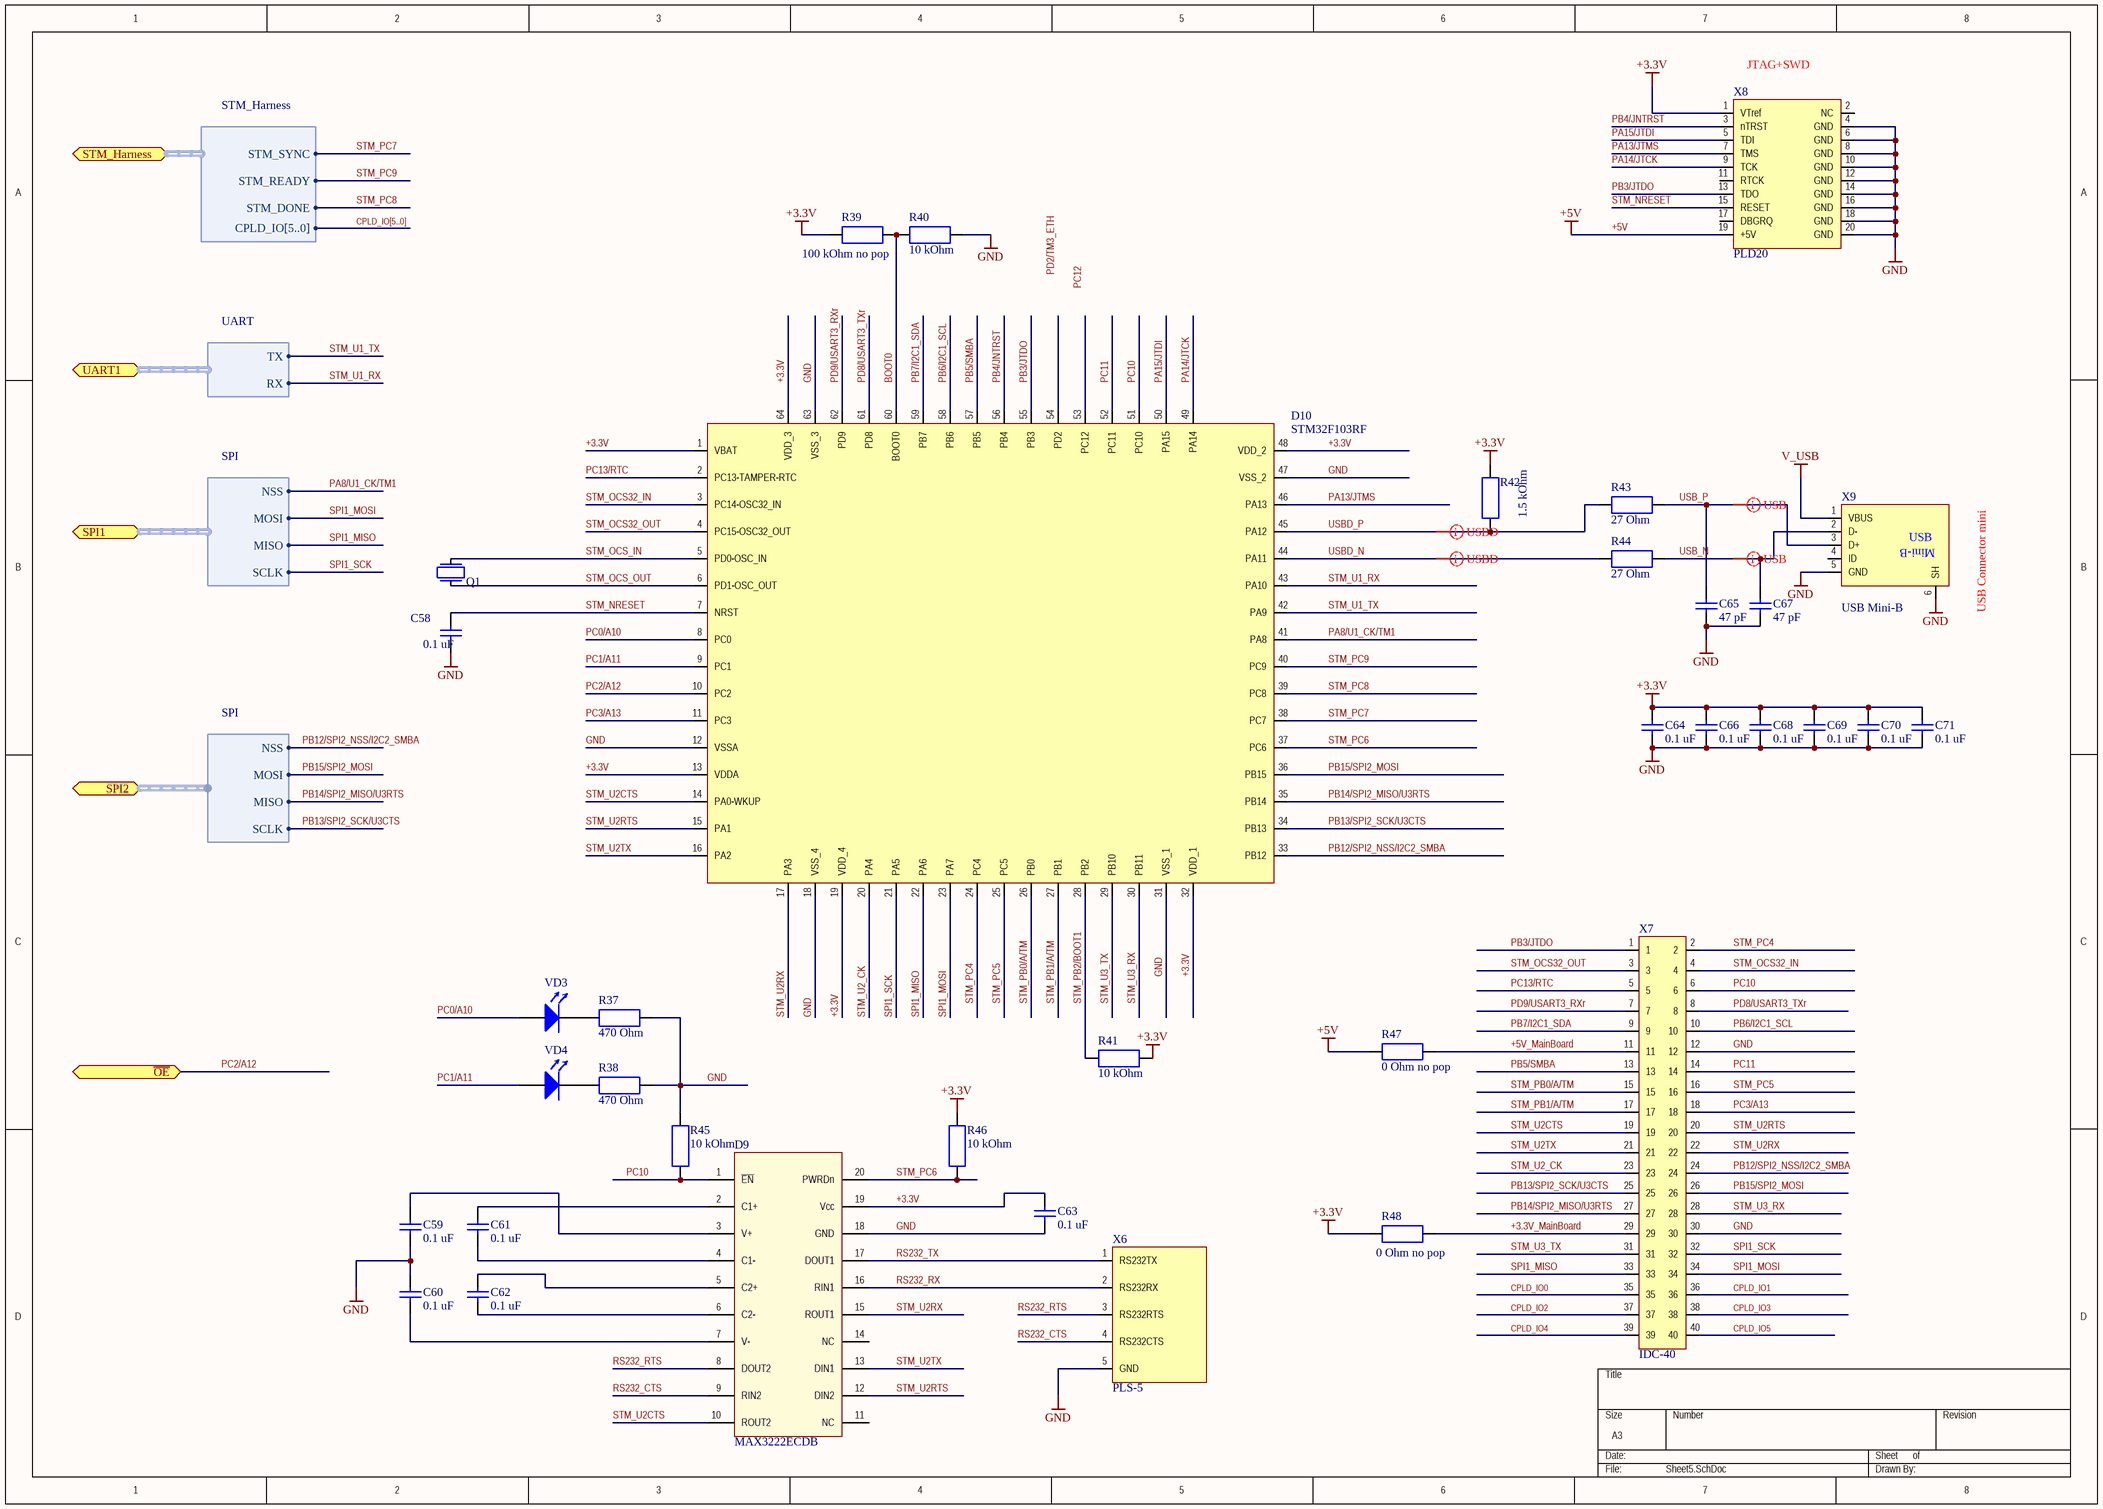
[diagram p4: Sheet5.SchDoc]

### Parts
C58  0.1 uF  [CAPC1608N]
C59  0.1 uF  [CAPC1608N]
C60  0.1 uF  [CAPC1608N]
C61  0.1 uF  [CAPC1608N]
C62  0.1 uF  [CAPC1608N]
C63  0.1 uF  [CAPC1608N]
C64  0.1 uF  [CAPC1608N]
C65  47 pF  [CAPC1608N]
C66  0.1 uF  [CAPC1608N]
C67  47 pF  [CAPC1608N]
C68  0.1 uF  [CAPC1608N]
C69  0.1 uF  [CAPC1608N]
C70  0.1 uF  [CAPC1608N]
C71  0.1 uF  [CAPC1608N]
D9  MAX3222ECDB  [SOP65P780X200-20N]
D10  STM32F103RF  [LQFP64]
Q1  Quarz  [HC-49/U3H]  (value not drawn)
R37  470 Ohm  [RESC1608N]
R38  470 Ohm  [RESC1608N]
R39  100 kOhm no pop  [RESC1608N]
R40  10 kOhm  [RESC1608N]
R41  10 kOhm  [RESC1608N]
R42  1.5 kOhm  [RESC1608N]
R43  27 Ohm  [RESC1608N]
R44  27 Ohm  [RESC1608N]
R45  10 kOhm  [RESC1608N]
R46  10 kOhm  [RESC1608N]
R47  0 Ohm no pop  [RESC1608N]
R48  0 Ohm no pop  [RESC1608N]
VD3  KP-1608SURC  [LED1608N]  (value not drawn)
VD4  KP-1608SURC  [LED1608N]  (value not drawn)
X6  PLS-5  [PLS-5]
X7  IDC-40  [PLD-40]
X8  PLD20  [PLD-20]
X9  USB Mini-B  [USBMINIB]

### Ports
SPI1 (harness SPI), SPI2 (harness SPI), STM_Harness (harness STM_Harness), UART1 (harness UART), ~{OE}

### Harnesses
STM_Harness: STM_DONE, STM_READY, STM_SYNC, CPLD_IO[5..0]
SPI: NSS, MOSI, MISO, SCLK
UART: TX, RX

### Nets
+3.3V: C63.2 C64.2 C66.2 C68.2 C69.2 C70.2 C71.2 D9.19(Vcc) D10.1(VBAT) D10.13(VDDA) D10.19(VDD_4) D10.32(VDD_1) D10.48(VDD_2) D10.64(VDD_3) R39.2 R41.1 R42.2 R46.2 R48.2 X8.1(VTref)
+5V: R47.2 X8.19(+5V)
GND: C58.1 C59.1 C60.2 C63.1 C64.1 C65.1 C66.1 C67.1 C68.1 C69.1 C70.1 C71.1 D9.18(GND) D10.12(VSSA) D10.18(VSS_4) D10.31(VSS_1) D10.47(VSS_2) D10.63(VSS_3) R37.2 R38.2 R40.1 R45.2 X6.5(GND) X7.12 X7.30 X8.4(GND) X8.6(GND) X8.8(GND) X8.10(GND) X8.12(GND) X8.14(GND) X8.16(GND) X8.18(GND) X8.20(GND) X9.5(GND) X9.6(SH)
V_USB: X9.1(VBUS)
+3.3V_MainBoard: R48.1 X7.29
+5V_MainBoard: R47.1 X7.11
BOOT0: D10.60(BOOT0) R39.1 R40.2
CPLD_IO0: X7.35
CPLD_IO1: X7.36
CPLD_IO2: X7.37
CPLD_IO3: X7.38
CPLD_IO4: X7.39
CPLD_IO5: X7.40
PA8/U1_CK/TM1: D10.41(PA8) ; port SPI1.NSS
PA13/JTMS: D10.46(PA13) X8.7(TMS)
PA14/JTCK: D10.49(PA14) X8.9(TCK)
PA15/JTDI: D10.50(PA15) X8.5(TDI)
PB3/JTDO: D10.55(PB3) X7.1 X8.13(TDO)
PB4/JNTRST: D10.56(PB4) X8.3(nTRST)
PB5/SMBA: D10.57(PB5) X7.13
PB6/I2C1_SCL: D10.58(PB6) X7.10
PB7/I2C1_SDA: D10.59(PB7) X7.9
PB12/SPI2_NSS/I2C2_SMBA: D10.33(PB12) X7.24 ; port SPI2.NSS
PB13/SPI2_SCK/U3CTS: D10.34(PB13) X7.25 ; port SPI2.SCLK
PB14/SPI2_MISO/U3RTS: D10.35(PB14) X7.27 ; port SPI2.MISO
PB15/SPI2_MOSI: D10.36(PB15) X7.26 ; port SPI2.MOSI
PC0/A10: D10.8(PC0) VD3.1(A)
PC1/A11: D10.9(PC1) VD4.1(A)
PC2/A12: D10.10(PC2) ; port ~{OE}  [project net ~{OE}]
PC3/A13: D10.11(PC3) X7.18
PC10: D9.1(~{EN}) D10.51(PC10) R45.1 X7.6
PC11: D10.52(PC11) X7.14
PC13/RTC: D10.2(PC13-TAMPER-RTC) X7.5
PD8/USART3_TXr: D10.61(PD8) X7.8
PD9/USART3_RXr: D10.62(PD9) X7.7
RS232_CTS: D9.9(RIN2) X6.4(RS232CTS)
RS232_RTS: D9.8(DOUT2) X6.3(RS232RTS)
RS232_RX: D9.16(RIN1) X6.2(RS232RX)
RS232_TX: D9.17(DOUT1) X6.1(RS232TX)
SPI1_MISO: D10.22(PA6) X7.33 ; port SPI1.MISO
SPI1_MOSI: D10.23(PA7) X7.34 ; port SPI1.MOSI
SPI1_SCK: D10.21(PA5) X7.32 ; port SPI1.SCLK
STM_NRESET: C58.2 D10.7(NRST) X8.15(RESET)
STM_OCS32_IN: D10.3(PC14-OSC32_IN) X7.4
STM_OCS32_OUT: D10.4(PC15-OSC32_OUT) X7.3
STM_OCS_IN: D10.5(PD0-OSC_IN) Q1.2
STM_OCS_OUT: D10.6(PD1-OSC_OUT) Q1.1
STM_PB0/A/TM: D10.26(PB0) X7.15
STM_PB1/A/TM: D10.27(PB1) X7.17
STM_PB2/BOOT1: D10.28(PB2) R41.2
STM_PC4: D10.24(PC4) X7.2
STM_PC5: D10.25(PC5) X7.16
STM_PC6: D9.20(PWRDn) D10.37(PC6) R46.1
STM_PC7: D10.38(PC7) ; port STM_Harness.STM_SYNC
STM_PC8: D10.39(PC8) ; port STM_Harness.STM_DONE  [project net STM_DONE]
STM_PC9: D10.40(PC9) ; port STM_Harness.STM_READY
STM_U1_RX: D10.43(PA10) ; port UART1.RX
STM_U1_TX: D10.42(PA9) ; port UART1.TX
STM_U2_CK: D10.20(PA4) X7.23
STM_U2CTS: D9.10(ROUT2) D10.14(PA0-WKUP) X7.19
STM_U2RTS: D9.12(DIN2) D10.15(PA1) X7.20
STM_U2RX: D9.15(ROUT1) D10.17(PA3) X7.22
STM_U2TX: D9.13(DIN1) D10.16(PA2) X7.21
STM_U3_RX: D10.30(PB11) X7.28
STM_U3_TX: D10.29(PB10) X7.31
USB_N: C67.2 R44.1 X9.2(D-)
USB_P: C65.2 R43.1 X9.3(D+)
USBD_N: D10.44(PA11) R44.2
USBD_P: D10.45(PA12) R42.1 R43.2
NetC59_2: C59.2 D9.3(V+)
NetC60_1: C60.1 D9.7(V-)
NetC61_1: C61.1 D9.4(C1-)
NetC61_2: C61.2 D9.2(C1+)
NetC62_1: C62.1 D9.6(C2-)
NetC62_2: C62.2 D9.5(C2+)
NetR37_1: R37.1 VD3.2(K)
NetR38_1: R38.1 VD4.2(K)

Not connected (* = marked no-connect by the designer): D9 11(NC) 14(NC); D10 53(PC12) 54(PD2); X8 2(NC) 11(RTCK) 17(DBGRQ); X9 4(ID)

### Buses and harness runs
bus CPLD_IO[5..0]

### Layout directives
differential pair: USB_N, USB_P, USBD_N, USBD_P

### Notes on the sheet
- (near X8) JTAG+SWD
- (near X9) USB Connector mini
- Labels drawn without touching a wire or pin: PC12, PD2/TM3_ETH
- (in symbol USB-MINI-B) USB; Mini-B

### Library data of the parts
C58-C71 = CC0603: as C1 on sheet Sheet2; Published: 2014; LatestRevisionDate: 2014; LatestRevisionNote: Re-released for DXP Platform.; PackageReference: RAD-0.3; Publisher: DS; PackageDescription: ChipCapasitor; HelpURL: http://product.tdk.com/capacitor/mlcc/en/documents/mlcc_commercial_general_en.pdf; Supplier 1: Digi-Key; Supplier Part Number 1: 445-4998-1-ND
D9 = MAX3222ECDB: RS232 driver
D10 = STM32F103RF: STM32F103RF LQFP64
Q1 = Quarz: Ceramic quarz; MaxVoltage: 10Vdc; Value: 1µF; Published: 2014; LatestRevisionDate: 2014; LatestRevisionNote: Re-released for DXP Platform.; PackageReference: RAD-0.3; Publisher: DS; PackageDescription: ChipCapasitor; HelpURL: http://product.tdk.com/capacitor/mlcc/en/documents/mlcc_commercial_general_en.pdf
R37-R48 = RES0603: ±5%, 0603; MaxVoltage: 10Vdc; Value: 1µF; Published: 2014; LatestRevisionDate: 2014; LatestRevisionNote: Re-released for DXP Platform.; PackageReference: RAD-0.3; Publisher: DS; PackageDescription: ChipCapasitor; HelpURL: http://product.tdk.com/capacitor/mlcc/en/documents/mlcc_commercial_general_en.pdf
X6 = RS232
X7 = IDC40: PLD-40 or IDC 40
X8 = JTAG
X9 = USB-MINI-B
VD3 VD4 = KP-1608SURC: Published: 29-Sep-2000; LatestRevisionDate: 17-Jul-2002; LatestRevisionNote: Re-released for DXP Platform.; PackageReference: 299-02; Publisher: Altium Limited; PackageDescription: Diode, Axial; Body 5.1 x 2.3 mm (LxDia. max), Lead Dia. 0.56 mm (max); Code_JEDEC: DO-204-AH; ComponentLink1Description: Manufacturer Link; ComponentLink1URL: http://www.onsemi.com/site/products/landing?taxonomyID=194

## Sheet Sheet6.SchDoc
size A3
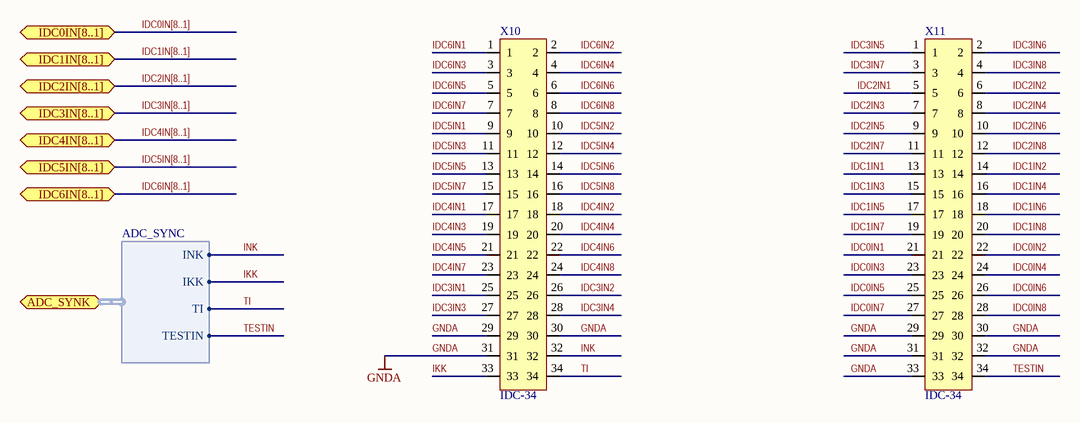
[diagram p5: Sheet6.SchDoc]

### Parts
X10  IDC-34  [PLD-34]
X11  IDC-34  [PLD-34]

### Ports
ADC_SYNK (harness ADC_SYNC), IDC0IN[8..1], IDC1IN[8..1], IDC2IN[8..1], IDC3IN[8..1], IDC4IN[8..1], IDC5IN[8..1], IDC6IN[8..1]

### Harnesses
ADC_SYNC: INK, IKK, TI, TESTIN

### Nets
GNDA: X10.29 X10.30 X10.31 X11.29 X11.30 X11.31 X11.32 X11.33
IDC0IN1: X11.21
IDC0IN2: X11.22
IDC0IN3: X11.23
IDC0IN4: X11.24
IDC0IN5: X11.25
IDC0IN6: X11.26
IDC0IN7: X11.27
IDC0IN8: X11.28
IDC1IN1: X11.13
IDC1IN2: X11.14
IDC1IN3: X11.15
IDC1IN4: X11.16
IDC1IN5: X11.17
IDC1IN6: X11.18
IDC1IN7: X11.19
IDC1IN8: X11.20
IDC2IN1: X11.5
IDC2IN2: X11.6
IDC2IN3: X11.7
IDC2IN4: X11.8
IDC2IN5: X11.9
IDC2IN6: X11.10
IDC2IN7: X11.11
IDC2IN8: X11.12
IDC3IN1: X10.25
IDC3IN2: X10.26
IDC3IN3: X10.27
IDC3IN4: X10.28
IDC3IN5: X11.1
IDC3IN6: X11.2
IDC3IN7: X11.3
IDC3IN8: X11.4
IDC4IN1: X10.17
IDC4IN2: X10.18
IDC4IN3: X10.19
IDC4IN4: X10.20
IDC4IN5: X10.21
IDC4IN6: X10.22
IDC4IN7: X10.23
IDC4IN8: X10.24
IDC5IN1: X10.9
IDC5IN2: X10.10
IDC5IN3: X10.11
IDC5IN4: X10.12
IDC5IN5: X10.13
IDC5IN6: X10.14
IDC5IN7: X10.15
IDC5IN8: X10.16
IDC6IN1: X10.1
IDC6IN2: X10.2
IDC6IN3: X10.3
IDC6IN4: X10.4
IDC6IN5: X10.5
IDC6IN6: X10.6
IDC6IN7: X10.7
IDC6IN8: X10.8
IKK: X10.33 ; port ADC_SYNK.IKK
INK: X10.32 ; port ADC_SYNK.INK
TestIn: X11.34 ; port ADC_SYNK.TESTIN
TI: X10.34 ; port ADC_SYNK.TI

### Buses and harness runs
bus IDC0IN[8..1] = port IDC0IN[8..1]
bus IDC1IN[8..1] = port IDC1IN[8..1]
bus IDC2IN[8..1] = port IDC2IN[8..1]
bus IDC3IN[8..1] = port IDC3IN[8..1]
bus IDC4IN[8..1] = port IDC4IN[8..1]
bus IDC5IN[8..1] = port IDC5IN[8..1]
bus IDC6IN[8..1] = port IDC6IN[8..1]

### Library data of the parts
X10 X11 = IDC34: PLD-34 or IDC 34

## Nets that join several sheets
+1.8V: Sheet4 (8 pins), Sheet3 (7 pins)
+3.3V: A2.3 (C10_A2.3.2 D1_A2.3.23 R10_A2.3.1), A2.4 (C10_A2.4.2 D1_A2.4.23 R10_A2.4.1), A2.5 (C10_A2.5.2 D1_A2.5.23 R10_A2.5.1), A2.6 (C10_A2.6.2 D1_A2.6.23 R10_A2.6.1), A2.1 (C10_A2.1.2 D1_A2.1.23 R10_A2.1.1), A2.2 (C10_A2.2.2 D1_A2.2.23 R10_A2.2.1), Sheet4 (16 pins), Sheet3 (9 pins), Sheet5 (20 pins), A2.0 (C10_A2.0.2 D1_A2.0.23 R10_A2.0.1)
+5V: Sheet3 (14 pins), Sheet5 (R47.2 X8.19)
+5VA: A2.3 (8 pins), A2.4 (8 pins), A2.5 (8 pins), A2.6 (8 pins), A2.1 (8 pins), A2.2 (8 pins), Sheet3 (8 pins), A2.0 (8 pins)
GND: Sheet4 (29 pins), Sheet3 (34 pins), Sheet5 (36 pins)
GNDA: A2.3 (29 pins), A2.4 (29 pins), A2.5 (29 pins), A2.6 (29 pins), A2.1 (29 pins), A2.2 (29 pins), Sheet3 (12 pins), A2.0 (29 pins), Sheet6 (8 pins)
BUSY: A2.3 (D1_A2.3.14), Sheet4 (D8.70)
BUSY: A2.4 (D1_A2.4.14), Sheet4 (D8.76)
BUSY: A2.5 (D1_A2.5.14), Sheet4 (D8.67)
BUSY: A2.6 (D1_A2.6.14), Sheet4 (D8.61)
BUSY: A2.1 (D1_A2.1.14), Sheet4 (D8.81)
BUSY: A2.2 (D1_A2.2.14), Sheet4 (D8.73)
BUSY: Sheet4 (D8.84), A2.0 (D1_A2.0.14)
~{CS}: A2.3 (D1_A2.3.13), Sheet4 (D8.69)
~{CS}: A2.4 (D1_A2.4.13), Sheet4 (D8.77)
~{CS}: A2.5 (D1_A2.5.13), Sheet4 (D8.68)
~{CS}: A2.6 (D1_A2.6.13), Sheet4 (D8.62)
~{CS}: A2.1 (D1_A2.1.13), Sheet4 (D8.78)
~{CS}: A2.2 (D1_A2.2.13), Sheet4 (D8.72)
~{CS}: Sheet4 (D8.85), A2.0 (D1_A2.0.13)
CLK: Sheet4 (D8.92), Sheet3 (D2.8)
CONVSTA: A2.3 (D1_A2.3.9), A2.4 (D1_A2.4.9), A2.5 (D1_A2.5.9), A2.6 (D1_A2.6.9), A2.1 (D1_A2.1.9), A2.2 (D1_A2.2.9), Sheet4 (D8.38 R30.2), A2.0 (D1_A2.0.9)
CONVSTB: A2.3 (D1_A2.3.10), A2.4 (D1_A2.4.10), A2.5 (D1_A2.5.10), A2.6 (D1_A2.6.10), A2.1 (D1_A2.1.10), A2.2 (D1_A2.2.10), Sheet4 (D8.35 R30.1), A2.0 (D1_A2.0.10)
CPLD_IO0: Sheet4 (D8.15), Sheet5 (X7.35)
CPLD_IO1: Sheet4 (D8.16), Sheet5 (X7.36)
CPLD_IO2: Sheet4 (D8.17), Sheet5 (X7.37)
CPLD_IO3: Sheet4 (D8.18), Sheet5 (X7.38)
CPLD_IO4: Sheet4 (D8.19), Sheet5 (X7.39)
CPLD_IO5: Sheet4 (D8.33), Sheet5 (X7.40)
DATA0: A2.3 (D1_A2.3.16), A2.4 (D1_A2.4.16), A2.5 (D1_A2.5.16), A2.6 (D1_A2.6.16), A2.1 (D1_A2.1.16), A2.2 (D1_A2.2.16), Sheet4 (D8.57), A2.0 (D1_A2.0.16)
DATA1: A2.3 (D1_A2.3.17), A2.4 (D1_A2.4.17), A2.5 (D1_A2.5.17), A2.6 (D1_A2.6.17), A2.1 (D1_A2.1.17), A2.2 (D1_A2.2.17), Sheet4 (D8.56), A2.0 (D1_A2.0.17)
DATA2: A2.3 (D1_A2.3.18), A2.4 (D1_A2.4.18), A2.5 (D1_A2.5.18), A2.6 (D1_A2.6.18), A2.1 (D1_A2.1.18), A2.2 (D1_A2.2.18), Sheet4 (D8.55), A2.0 (D1_A2.0.18)
DATA3: A2.3 (D1_A2.3.19), A2.4 (D1_A2.4.19), A2.5 (D1_A2.5.19), A2.6 (D1_A2.6.19), A2.1 (D1_A2.1.19), A2.2 (D1_A2.2.19), Sheet4 (D8.54), A2.0 (D1_A2.0.19)
DATA4: A2.3 (D1_A2.3.20), A2.4 (D1_A2.4.20), A2.5 (D1_A2.5.20), A2.6 (D1_A2.6.20), A2.1 (D1_A2.1.20), A2.2 (D1_A2.2.20), Sheet4 (D8.53), A2.0 (D1_A2.0.20)
DATA5: A2.3 (D1_A2.3.21), A2.4 (D1_A2.4.21), A2.5 (D1_A2.5.21), A2.6 (D1_A2.6.21), A2.1 (D1_A2.1.21), A2.2 (D1_A2.2.21), Sheet4 (D8.52), A2.0 (D1_A2.0.21)
DATA6: A2.3 (D1_A2.3.22), A2.4 (D1_A2.4.22), A2.5 (D1_A2.5.22), A2.6 (D1_A2.6.22), A2.1 (D1_A2.1.22), A2.2 (D1_A2.2.22), Sheet4 (D8.51), A2.0 (D1_A2.0.22)
DATA7: A2.3 (D1_A2.3.24), A2.4 (D1_A2.4.24), A2.5 (D1_A2.5.24), A2.6 (D1_A2.6.24), A2.1 (D1_A2.1.24), A2.2 (D1_A2.2.24), Sheet4 (D8.50), A2.0 (D1_A2.0.24)
DATA8: A2.3 (D1_A2.3.25), A2.4 (D1_A2.4.25), A2.5 (D1_A2.5.25), A2.6 (D1_A2.6.25), A2.1 (D1_A2.1.25), A2.2 (D1_A2.2.25), Sheet4 (D8.49), A2.0 (D1_A2.0.25)
DATA9: A2.3 (D1_A2.3.27), A2.4 (D1_A2.4.27), A2.5 (D1_A2.5.27), A2.6 (D1_A2.6.27), A2.1 (D1_A2.1.27), A2.2 (D1_A2.2.27), Sheet4 (D8.48), A2.0 (D1_A2.0.27)
DATA10: A2.3 (D1_A2.3.28), A2.4 (D1_A2.4.28), A2.5 (D1_A2.5.28), A2.6 (D1_A2.6.28), A2.1 (D1_A2.1.28), A2.2 (D1_A2.2.28), Sheet4 (D8.47), A2.0 (D1_A2.0.28)
DATA11: A2.3 (D1_A2.3.29), A2.4 (D1_A2.4.29), A2.5 (D1_A2.5.29), A2.6 (D1_A2.6.29), A2.1 (D1_A2.1.29), A2.2 (D1_A2.2.29), Sheet4 (D8.44), A2.0 (D1_A2.0.29)
DATA12: A2.3 (D1_A2.3.30), A2.4 (D1_A2.4.30), A2.5 (D1_A2.5.30), A2.6 (D1_A2.6.30), A2.1 (D1_A2.1.30), A2.2 (D1_A2.2.30), Sheet4 (D8.43), A2.0 (D1_A2.0.30)
DATA13: A2.3 (D1_A2.3.31), A2.4 (D1_A2.4.31), A2.5 (D1_A2.5.31), A2.6 (D1_A2.6.31), A2.1 (D1_A2.1.31), A2.2 (D1_A2.2.31), Sheet4 (D8.42), A2.0 (D1_A2.0.31)
DATA14: A2.3 (D1_A2.3.32), A2.4 (D1_A2.4.32), A2.5 (D1_A2.5.32), A2.6 (D1_A2.6.32), A2.1 (D1_A2.1.32), A2.2 (D1_A2.2.32), Sheet4 (D8.41), A2.0 (D1_A2.0.32)
DATA15: A2.3 (D1_A2.3.33), A2.4 (D1_A2.4.33), A2.5 (D1_A2.5.33), A2.6 (D1_A2.6.33), A2.1 (D1_A2.1.33), A2.2 (D1_A2.2.33), Sheet4 (D8.40), A2.0 (D1_A2.0.33)
FrameStart: Sheet4 (D8.87), Sheet3 (D2.3)
FrameStop: Sheet4 (D8.89), Sheet3 (D2.6)
FRSTDATA: A2.3 (D1_A2.3.15), Sheet4 (D8.71)
FRSTDATA: A2.4 (D1_A2.4.15), Sheet4 (D8.75)
FRSTDATA: A2.5 (D1_A2.5.15), Sheet4 (D8.66)
FRSTDATA: A2.6 (D1_A2.6.15), Sheet4 (D8.58)
FRSTDATA: A2.1 (D1_A2.1.15), Sheet4 (D8.82)
FRSTDATA: A2.2 (D1_A2.2.15), Sheet4 (D8.74)
FRSTDATA: Sheet4 (D8.83), A2.0 (D1_A2.0.15)
IDC0IN1: A2.0 (RN1_A2.0.5), Sheet6 (X11.21)
IDC0IN2: A2.0 (RN1_A2.0.6), Sheet6 (X11.22)
IDC0IN3: A2.0 (RN1_A2.0.7), Sheet6 (X11.23)
IDC0IN4: A2.0 (RN1_A2.0.8), Sheet6 (X11.24)
IDC0IN5: A2.0 (RN2_A2.0.5), Sheet6 (X11.25)
IDC0IN6: A2.0 (RN2_A2.0.6), Sheet6 (X11.26)
IDC0IN7: A2.0 (RN2_A2.0.7), Sheet6 (X11.27)
IDC0IN8: A2.0 (RN2_A2.0.8), Sheet6 (X11.28)
IDC1IN1: A2.1 (RN1_A2.1.5), Sheet6 (X11.13)
IDC1IN2: A2.1 (RN1_A2.1.6), Sheet6 (X11.14)
IDC1IN3: A2.1 (RN1_A2.1.7), Sheet6 (X11.15)
IDC1IN4: A2.1 (RN1_A2.1.8), Sheet6 (X11.16)
IDC1IN5: A2.1 (RN2_A2.1.5), Sheet6 (X11.17)
IDC1IN6: A2.1 (RN2_A2.1.6), Sheet6 (X11.18)
IDC1IN7: A2.1 (RN2_A2.1.7), Sheet6 (X11.19)
IDC1IN8: A2.1 (RN2_A2.1.8), Sheet6 (X11.20)
IDC2IN1: A2.2 (RN1_A2.2.5), Sheet6 (X11.5)
IDC2IN2: A2.2 (RN1_A2.2.6), Sheet6 (X11.6)
IDC2IN3: A2.2 (RN1_A2.2.7), Sheet6 (X11.7)
IDC2IN4: A2.2 (RN1_A2.2.8), Sheet6 (X11.8)
IDC2IN5: A2.2 (RN2_A2.2.5), Sheet6 (X11.9)
IDC2IN6: A2.2 (RN2_A2.2.6), Sheet6 (X11.10)
IDC2IN7: A2.2 (RN2_A2.2.7), Sheet6 (X11.11)
IDC2IN8: A2.2 (RN2_A2.2.8), Sheet6 (X11.12)
IDC3IN1: A2.3 (RN1_A2.3.5), Sheet6 (X10.25)
IDC3IN2: A2.3 (RN1_A2.3.6), Sheet6 (X10.26)
IDC3IN3: A2.3 (RN1_A2.3.7), Sheet6 (X10.27)
IDC3IN4: A2.3 (RN1_A2.3.8), Sheet6 (X10.28)
IDC3IN5: A2.3 (RN2_A2.3.5), Sheet6 (X11.1)
IDC3IN6: A2.3 (RN2_A2.3.6), Sheet6 (X11.2)
IDC3IN7: A2.3 (RN2_A2.3.7), Sheet6 (X11.3)
IDC3IN8: A2.3 (RN2_A2.3.8), Sheet6 (X11.4)
IDC4IN1: A2.4 (RN1_A2.4.5), Sheet6 (X10.17)
IDC4IN2: A2.4 (RN1_A2.4.6), Sheet6 (X10.18)
IDC4IN3: A2.4 (RN1_A2.4.7), Sheet6 (X10.19)
IDC4IN4: A2.4 (RN1_A2.4.8), Sheet6 (X10.20)
IDC4IN5: A2.4 (RN2_A2.4.5), Sheet6 (X10.21)
IDC4IN6: A2.4 (RN2_A2.4.6), Sheet6 (X10.22)
IDC4IN7: A2.4 (RN2_A2.4.7), Sheet6 (X10.23)
IDC4IN8: A2.4 (RN2_A2.4.8), Sheet6 (X10.24)
IDC5IN1: A2.5 (RN1_A2.5.5), Sheet6 (X10.9)
IDC5IN2: A2.5 (RN1_A2.5.6), Sheet6 (X10.10)
IDC5IN3: A2.5 (RN1_A2.5.7), Sheet6 (X10.11)
IDC5IN4: A2.5 (RN1_A2.5.8), Sheet6 (X10.12)
IDC5IN5: A2.5 (RN2_A2.5.5), Sheet6 (X10.13)
IDC5IN6: A2.5 (RN2_A2.5.6), Sheet6 (X10.14)
IDC5IN7: A2.5 (RN2_A2.5.7), Sheet6 (X10.15)
IDC5IN8: A2.5 (RN2_A2.5.8), Sheet6 (X10.16)
IDC6IN1: A2.6 (RN1_A2.6.5), Sheet6 (X10.1)
IDC6IN2: A2.6 (RN1_A2.6.6), Sheet6 (X10.2)
IDC6IN3: A2.6 (RN1_A2.6.7), Sheet6 (X10.3)
IDC6IN4: A2.6 (RN1_A2.6.8), Sheet6 (X10.4)
IDC6IN5: A2.6 (RN2_A2.6.5), Sheet6 (X10.5)
IDC6IN6: A2.6 (RN2_A2.6.6), Sheet6 (X10.6)
IDC6IN7: A2.6 (RN2_A2.6.7), Sheet6 (X10.7)
IDC6IN8: A2.6 (RN2_A2.6.8), Sheet6 (X10.8)
IKK: Sheet3 (D2.5 X2.2), Sheet6 (X10.33)
INK: Sheet3 (D2.2 X2.1), Sheet6 (X10.32)
~{OE}: Sheet3 (5 pins), Sheet5 (D10.10)
OS0: A2.3 (D1_A2.3.3), A2.4 (D1_A2.4.3), A2.5 (D1_A2.5.3), A2.6 (D1_A2.6.3), A2.1 (D1_A2.1.3), A2.2 (D1_A2.2.3), Sheet4 (D8.26), A2.0 (D1_A2.0.3)
OS1: A2.3 (D1_A2.3.4), A2.4 (D1_A2.4.4), A2.5 (D1_A2.5.4), A2.6 (D1_A2.6.4), A2.1 (D1_A2.1.4), A2.2 (D1_A2.2.4), Sheet4 (D8.27), A2.0 (D1_A2.0.4)
OS2: A2.3 (D1_A2.3.5), A2.4 (D1_A2.4.5), A2.5 (D1_A2.5.5), A2.6 (D1_A2.6.5), A2.1 (D1_A2.1.5), A2.2 (D1_A2.2.5), Sheet4 (D8.28), A2.0 (D1_A2.0.5)
~{PAR}/SER: A2.3 (D1_A2.3.6), A2.4 (D1_A2.4.6), A2.5 (D1_A2.5.6), A2.6 (D1_A2.6.6), A2.1 (D1_A2.1.6), A2.2 (D1_A2.2.6), Sheet4 (D8.29 R28.2), A2.0 (D1_A2.0.6)
PA8/U1_CK/TM1: Sheet4 (D8.98), Sheet5 (D10.41)
PB12/SPI2_NSS/I2C2_SMBA: Sheet4 (D8.5), Sheet5 (D10.33 X7.24)
PB13/SPI2_SCK/U3CTS: Sheet4 (D8.4), Sheet5 (D10.34 X7.25)
PB14/SPI2_MISO/U3RTS: Sheet4 (D8.3), Sheet5 (D10.35 X7.27)
PB15/SPI2_MOSI: Sheet4 (D8.2), Sheet5 (D10.36 X7.26)
~{RD}/SCL: A2.3 (D1_A2.3.12), A2.4 (D1_A2.4.12), A2.5 (D1_A2.5.12), A2.6 (D1_A2.6.12), A2.1 (D1_A2.1.12), A2.2 (D1_A2.2.12), Sheet4 (D8.86), A2.0 (D1_A2.0.12)
RANGE: A2.3 (D1_A2.3.8), A2.4 (D1_A2.4.8), A2.5 (D1_A2.5.8), A2.6 (D1_A2.6.8), A2.1 (D1_A2.1.8), A2.2 (D1_A2.2.8), Sheet4 (D8.34 R29.2), A2.0 (D1_A2.0.8)
REFIN: A2.3 (C13_A2.3.1 C17_A2.3.1 D1_A2.3.42), A2.4 (C13_A2.4.1 C17_A2.4.1 D1_A2.4.42), A2.5 (C13_A2.5.1 C17_A2.5.1 D1_A2.5.42), A2.6 (C13_A2.6.1 C17_A2.6.1 D1_A2.6.42), A2.1 (C13_A2.1.1 C17_A2.1.1 D1_A2.1.42), A2.2 (C13_A2.2.1 C17_A2.2.1 D1_A2.2.42), Sheet3 (5 pins), A2.0 (C13_A2.0.1 C17_A2.0.1 D1_A2.0.42)
RESET: A2.3 (D1_A2.3.11), A2.4 (D1_A2.4.11), A2.5 (D1_A2.5.11), A2.6 (D1_A2.6.11), A2.1 (D1_A2.1.11), A2.2 (D1_A2.2.11), Sheet4 (D8.36), A2.0 (D1_A2.0.11)
~{STBY}: A2.3 (D1_A2.3.7), A2.4 (D1_A2.4.7), A2.5 (D1_A2.5.7), A2.6 (D1_A2.6.7), A2.1 (D1_A2.1.7), A2.2 (D1_A2.2.7), Sheet4 (D8.30 R31.1), A2.0 (D1_A2.0.7)
SPI1_MISO: Sheet4 (D8.7), Sheet5 (D10.22 X7.33)
SPI1_MOSI: Sheet4 (D8.6), Sheet5 (D10.23 X7.34)
SPI1_SCK: Sheet4 (D8.14), Sheet5 (D10.21 X7.32)
STM_DONE: Sheet4 (D8.100), Sheet5 (D10.39)
STM_PC7: Sheet4 (D8.1), Sheet5 (D10.38)
STM_PC9: Sheet4 (D8.99), Sheet5 (D10.40)
STM_U1_RX: Sheet4 (D8.96), Sheet5 (D10.43)
STM_U1_TX: Sheet4 (D8.97), Sheet5 (D10.42)
Test: Sheet4 (D8.91), Sheet3 (D2.11)
TestIn: Sheet3 (D2.12 X2.4), Sheet6 (X11.34)
TI: Sheet3 (D2.9 X2.3), Sheet6 (X10.34)